# EAGLE schematic UCirKitBreadboardWithEverything2Top (EAGLE 7.3.0)
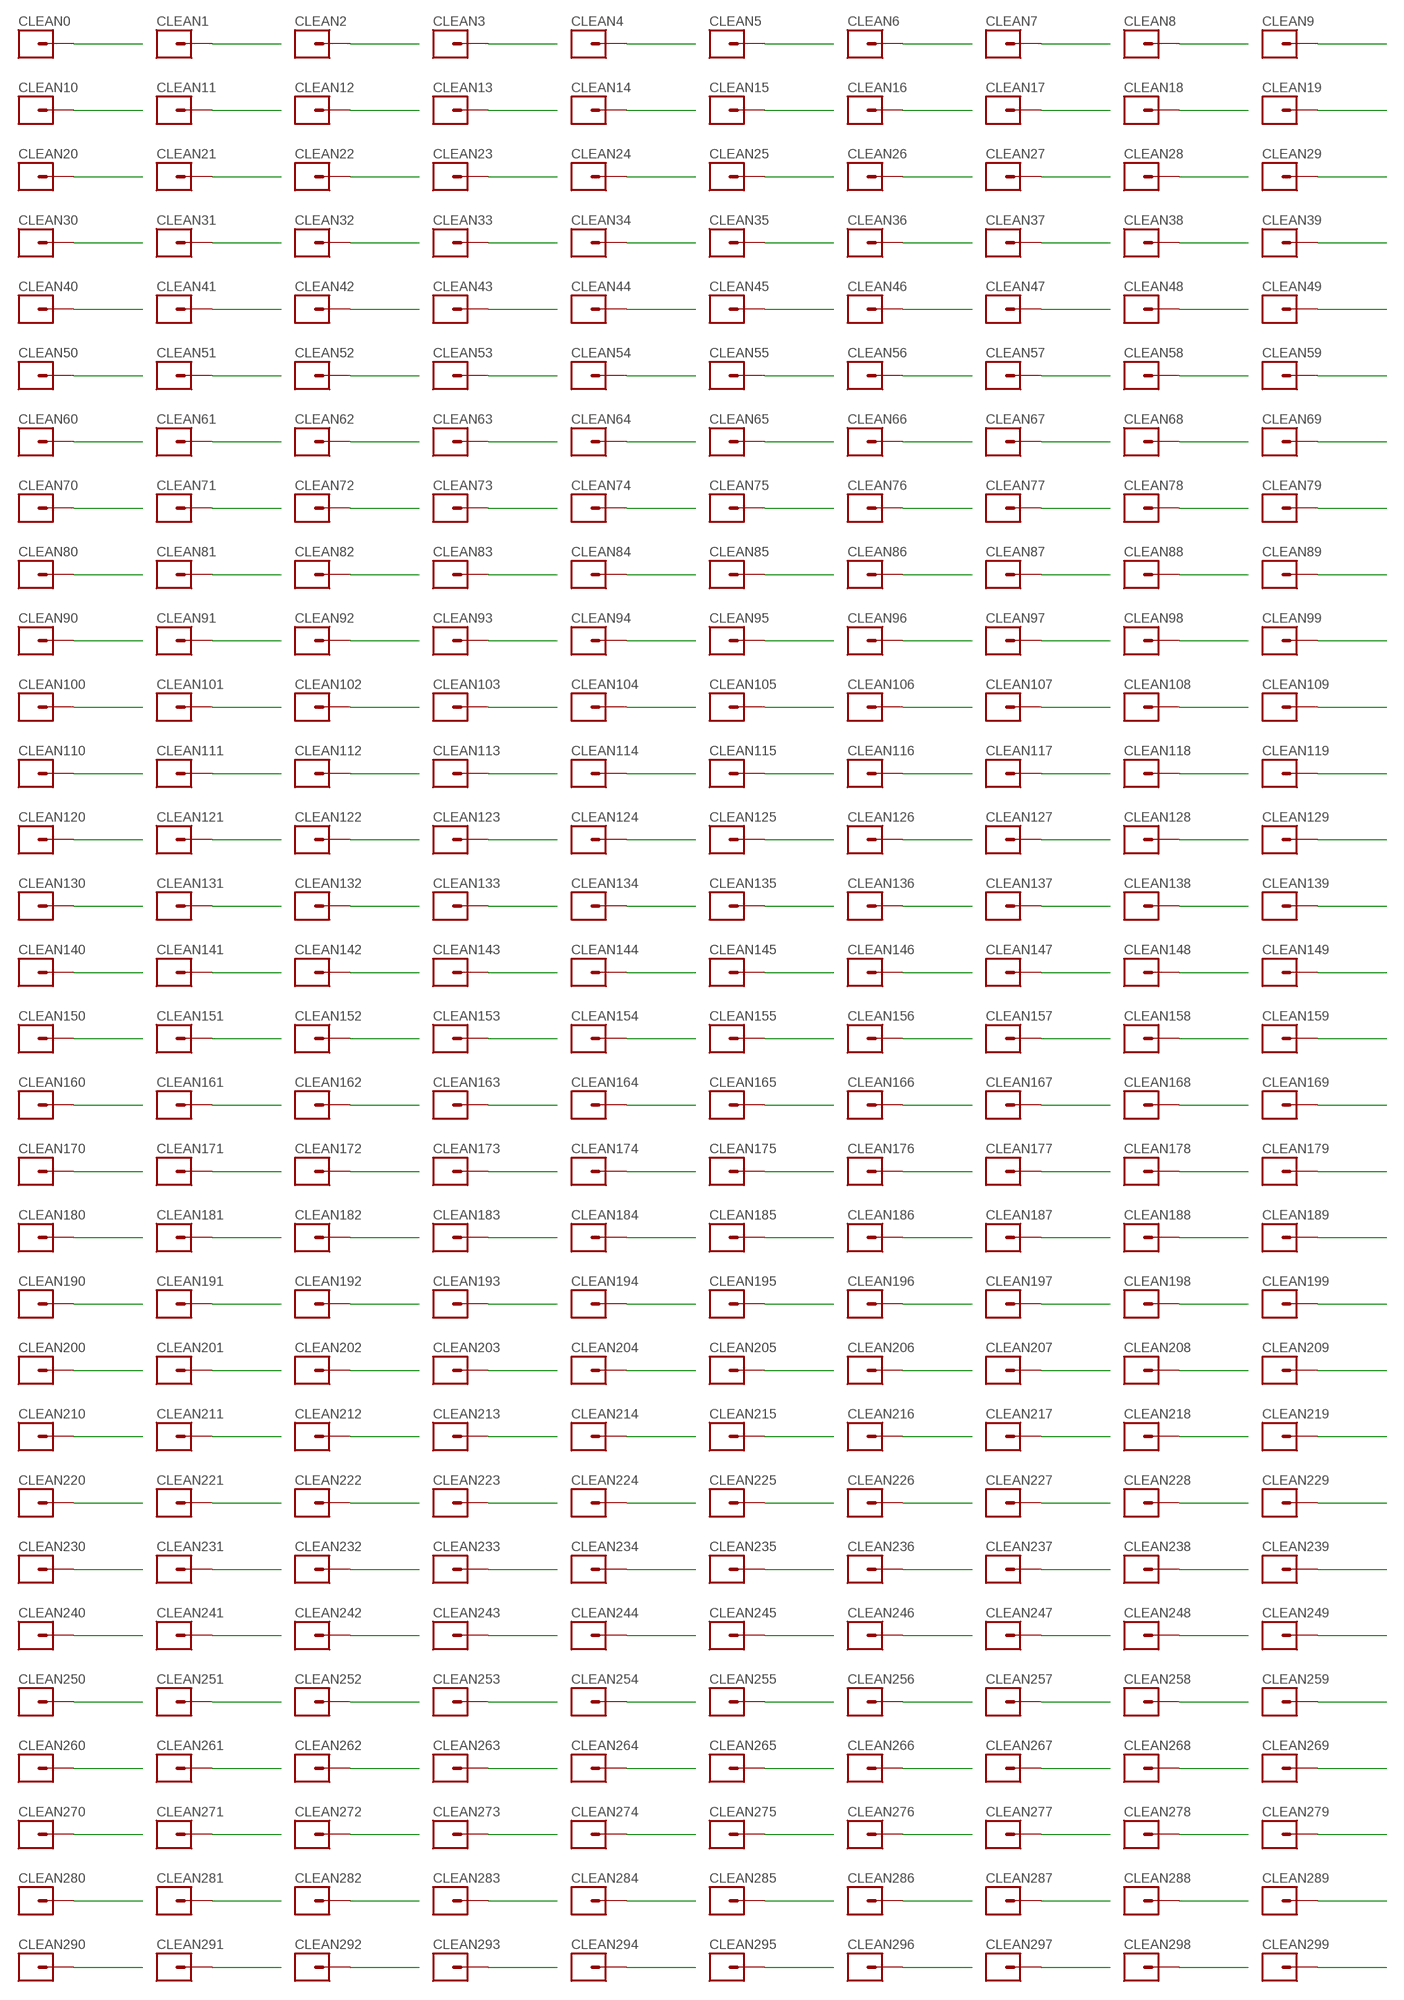
[diagram p0: schematic, sheet 1, part 1 of 2]
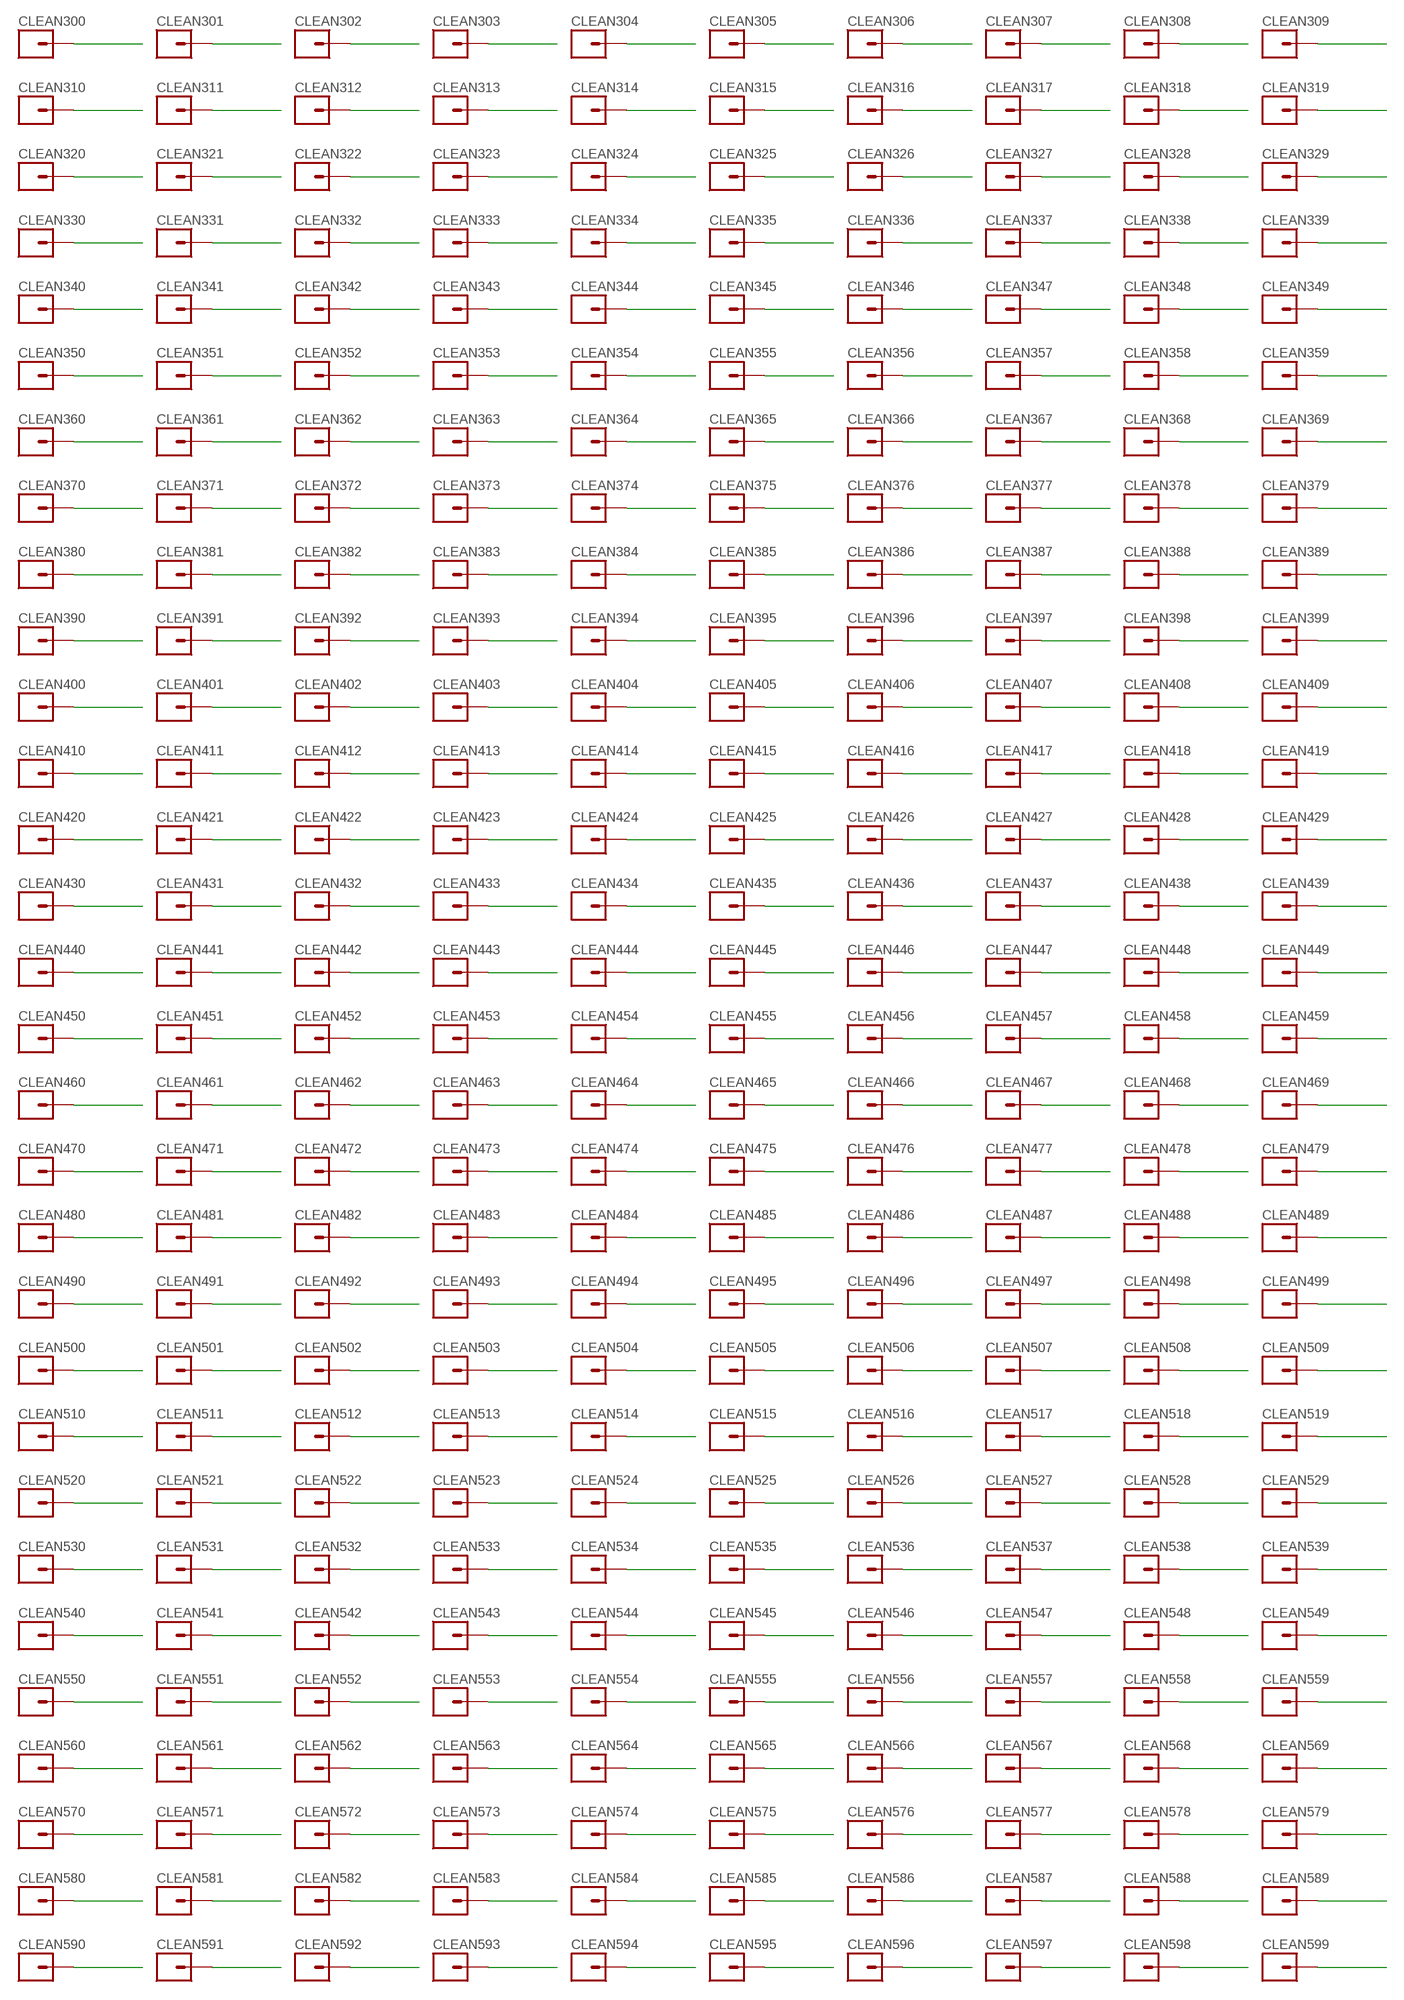
[diagram p1: schematic, sheet 1, part 2 of 2]

## Parts
CLEAN0  M01PTH_WITHOUT_TEXT  [1X01_WITHOUT_TEXT]
CLEAN1  M01PTH_WITHOUT_TEXT  [1X01_WITHOUT_TEXT]
CLEAN2  M01PTH_WITHOUT_TEXT  [1X01_WITHOUT_TEXT]
CLEAN3  M01PTH_WITHOUT_TEXT  [1X01_WITHOUT_TEXT]
CLEAN4  M01PTH_WITHOUT_TEXT  [1X01_WITHOUT_TEXT]
CLEAN5  M01PTH_WITHOUT_TEXT  [1X01_WITHOUT_TEXT]
CLEAN6  M01PTH_WITHOUT_TEXT  [1X01_WITHOUT_TEXT]
CLEAN7  M01PTH_WITHOUT_TEXT  [1X01_WITHOUT_TEXT]
CLEAN8  M01PTH_WITHOUT_TEXT  [1X01_WITHOUT_TEXT]
CLEAN9  M01PTH_WITHOUT_TEXT  [1X01_WITHOUT_TEXT]
CLEAN10  M01PTH_WITHOUT_TEXT  [1X01_WITHOUT_TEXT]
CLEAN11  M01PTH_WITHOUT_TEXT  [1X01_WITHOUT_TEXT]
CLEAN12  M01PTH_WITHOUT_TEXT  [1X01_WITHOUT_TEXT]
CLEAN13  M01PTH_WITHOUT_TEXT  [1X01_WITHOUT_TEXT]
CLEAN14  M01PTH_WITHOUT_TEXT  [1X01_WITHOUT_TEXT]
CLEAN15  M01PTH_WITHOUT_TEXT  [1X01_WITHOUT_TEXT]
CLEAN16  M01PTH_WITHOUT_TEXT  [1X01_WITHOUT_TEXT]
CLEAN17  M01PTH_WITHOUT_TEXT  [1X01_WITHOUT_TEXT]
CLEAN18  M01PTH_WITHOUT_TEXT  [1X01_WITHOUT_TEXT]
CLEAN19  M01PTH_WITHOUT_TEXT  [1X01_WITHOUT_TEXT]
CLEAN20  M01PTH_WITHOUT_TEXT  [1X01_WITHOUT_TEXT]
CLEAN21  M01PTH_WITHOUT_TEXT  [1X01_WITHOUT_TEXT]
CLEAN22  M01PTH_WITHOUT_TEXT  [1X01_WITHOUT_TEXT]
CLEAN23  M01PTH_WITHOUT_TEXT  [1X01_WITHOUT_TEXT]
CLEAN24  M01PTH_WITHOUT_TEXT  [1X01_WITHOUT_TEXT]
CLEAN25  M01PTH_WITHOUT_TEXT  [1X01_WITHOUT_TEXT]
CLEAN26  M01PTH_WITHOUT_TEXT  [1X01_WITHOUT_TEXT]
CLEAN27  M01PTH_WITHOUT_TEXT  [1X01_WITHOUT_TEXT]
CLEAN28  M01PTH_WITHOUT_TEXT  [1X01_WITHOUT_TEXT]
CLEAN29  M01PTH_WITHOUT_TEXT  [1X01_WITHOUT_TEXT]
CLEAN30  M01PTH_WITHOUT_TEXT  [1X01_WITHOUT_TEXT]
CLEAN31  M01PTH_WITHOUT_TEXT  [1X01_WITHOUT_TEXT]
CLEAN32  M01PTH_WITHOUT_TEXT  [1X01_WITHOUT_TEXT]
CLEAN33  M01PTH_WITHOUT_TEXT  [1X01_WITHOUT_TEXT]
CLEAN34  M01PTH_WITHOUT_TEXT  [1X01_WITHOUT_TEXT]
CLEAN35  M01PTH_WITHOUT_TEXT  [1X01_WITHOUT_TEXT]
CLEAN36  M01PTH_WITHOUT_TEXT  [1X01_WITHOUT_TEXT]
CLEAN37  M01PTH_WITHOUT_TEXT  [1X01_WITHOUT_TEXT]
CLEAN38  M01PTH_WITHOUT_TEXT  [1X01_WITHOUT_TEXT]
CLEAN39  M01PTH_WITHOUT_TEXT  [1X01_WITHOUT_TEXT]
CLEAN40  M01PTH_WITHOUT_TEXT  [1X01_WITHOUT_TEXT]
CLEAN41  M01PTH_WITHOUT_TEXT  [1X01_WITHOUT_TEXT]
CLEAN42  M01PTH_WITHOUT_TEXT  [1X01_WITHOUT_TEXT]
CLEAN43  M01PTH_WITHOUT_TEXT  [1X01_WITHOUT_TEXT]
CLEAN44  M01PTH_WITHOUT_TEXT  [1X01_WITHOUT_TEXT]
CLEAN45  M01PTH_WITHOUT_TEXT  [1X01_WITHOUT_TEXT]
CLEAN46  M01PTH_WITHOUT_TEXT  [1X01_WITHOUT_TEXT]
CLEAN47  M01PTH_WITHOUT_TEXT  [1X01_WITHOUT_TEXT]
CLEAN48  M01PTH_WITHOUT_TEXT  [1X01_WITHOUT_TEXT]
CLEAN49  M01PTH_WITHOUT_TEXT  [1X01_WITHOUT_TEXT]
CLEAN50  M01PTH_WITHOUT_TEXT  [1X01_WITHOUT_TEXT]
CLEAN51  M01PTH_WITHOUT_TEXT  [1X01_WITHOUT_TEXT]
CLEAN52  M01PTH_WITHOUT_TEXT  [1X01_WITHOUT_TEXT]
CLEAN53  M01PTH_WITHOUT_TEXT  [1X01_WITHOUT_TEXT]
CLEAN54  M01PTH_WITHOUT_TEXT  [1X01_WITHOUT_TEXT]
CLEAN55  M01PTH_WITHOUT_TEXT  [1X01_WITHOUT_TEXT]
CLEAN56  M01PTH_WITHOUT_TEXT  [1X01_WITHOUT_TEXT]
CLEAN57  M01PTH_WITHOUT_TEXT  [1X01_WITHOUT_TEXT]
CLEAN58  M01PTH_WITHOUT_TEXT  [1X01_WITHOUT_TEXT]
CLEAN59  M01PTH_WITHOUT_TEXT  [1X01_WITHOUT_TEXT]
CLEAN60  M01PTH_WITHOUT_TEXT  [1X01_WITHOUT_TEXT]
CLEAN61  M01PTH_WITHOUT_TEXT  [1X01_WITHOUT_TEXT]
CLEAN62  M01PTH_WITHOUT_TEXT  [1X01_WITHOUT_TEXT]
CLEAN63  M01PTH_WITHOUT_TEXT  [1X01_WITHOUT_TEXT]
CLEAN64  M01PTH_WITHOUT_TEXT  [1X01_WITHOUT_TEXT]
CLEAN65  M01PTH_WITHOUT_TEXT  [1X01_WITHOUT_TEXT]
CLEAN66  M01PTH_WITHOUT_TEXT  [1X01_WITHOUT_TEXT]
CLEAN67  M01PTH_WITHOUT_TEXT  [1X01_WITHOUT_TEXT]
CLEAN68  M01PTH_WITHOUT_TEXT  [1X01_WITHOUT_TEXT]
CLEAN69  M01PTH_WITHOUT_TEXT  [1X01_WITHOUT_TEXT]
CLEAN70  M01PTH_WITHOUT_TEXT  [1X01_WITHOUT_TEXT]
CLEAN71  M01PTH_WITHOUT_TEXT  [1X01_WITHOUT_TEXT]
CLEAN72  M01PTH_WITHOUT_TEXT  [1X01_WITHOUT_TEXT]
CLEAN73  M01PTH_WITHOUT_TEXT  [1X01_WITHOUT_TEXT]
CLEAN74  M01PTH_WITHOUT_TEXT  [1X01_WITHOUT_TEXT]
CLEAN75  M01PTH_WITHOUT_TEXT  [1X01_WITHOUT_TEXT]
CLEAN76  M01PTH_WITHOUT_TEXT  [1X01_WITHOUT_TEXT]
CLEAN77  M01PTH_WITHOUT_TEXT  [1X01_WITHOUT_TEXT]
CLEAN78  M01PTH_WITHOUT_TEXT  [1X01_WITHOUT_TEXT]
CLEAN79  M01PTH_WITHOUT_TEXT  [1X01_WITHOUT_TEXT]
CLEAN80  M01PTH_WITHOUT_TEXT  [1X01_WITHOUT_TEXT]
CLEAN81  M01PTH_WITHOUT_TEXT  [1X01_WITHOUT_TEXT]
CLEAN82  M01PTH_WITHOUT_TEXT  [1X01_WITHOUT_TEXT]
CLEAN83  M01PTH_WITHOUT_TEXT  [1X01_WITHOUT_TEXT]
CLEAN84  M01PTH_WITHOUT_TEXT  [1X01_WITHOUT_TEXT]
CLEAN85  M01PTH_WITHOUT_TEXT  [1X01_WITHOUT_TEXT]
CLEAN86  M01PTH_WITHOUT_TEXT  [1X01_WITHOUT_TEXT]
CLEAN87  M01PTH_WITHOUT_TEXT  [1X01_WITHOUT_TEXT]
CLEAN88  M01PTH_WITHOUT_TEXT  [1X01_WITHOUT_TEXT]
CLEAN89  M01PTH_WITHOUT_TEXT  [1X01_WITHOUT_TEXT]
CLEAN90  M01PTH_WITHOUT_TEXT  [1X01_WITHOUT_TEXT]
CLEAN91  M01PTH_WITHOUT_TEXT  [1X01_WITHOUT_TEXT]
CLEAN92  M01PTH_WITHOUT_TEXT  [1X01_WITHOUT_TEXT]
CLEAN93  M01PTH_WITHOUT_TEXT  [1X01_WITHOUT_TEXT]
CLEAN94  M01PTH_WITHOUT_TEXT  [1X01_WITHOUT_TEXT]
CLEAN95  M01PTH_WITHOUT_TEXT  [1X01_WITHOUT_TEXT]
CLEAN96  M01PTH_WITHOUT_TEXT  [1X01_WITHOUT_TEXT]
CLEAN97  M01PTH_WITHOUT_TEXT  [1X01_WITHOUT_TEXT]
CLEAN98  M01PTH_WITHOUT_TEXT  [1X01_WITHOUT_TEXT]
CLEAN99  M01PTH_WITHOUT_TEXT  [1X01_WITHOUT_TEXT]
CLEAN100  M01PTH_WITHOUT_TEXT  [1X01_WITHOUT_TEXT]
CLEAN101  M01PTH_WITHOUT_TEXT  [1X01_WITHOUT_TEXT]
CLEAN102  M01PTH_WITHOUT_TEXT  [1X01_WITHOUT_TEXT]
CLEAN103  M01PTH_WITHOUT_TEXT  [1X01_WITHOUT_TEXT]
CLEAN104  M01PTH_WITHOUT_TEXT  [1X01_WITHOUT_TEXT]
CLEAN105  M01PTH_WITHOUT_TEXT  [1X01_WITHOUT_TEXT]
CLEAN106  M01PTH_WITHOUT_TEXT  [1X01_WITHOUT_TEXT]
CLEAN107  M01PTH_WITHOUT_TEXT  [1X01_WITHOUT_TEXT]
CLEAN108  M01PTH_WITHOUT_TEXT  [1X01_WITHOUT_TEXT]
CLEAN109  M01PTH_WITHOUT_TEXT  [1X01_WITHOUT_TEXT]
CLEAN110  M01PTH_WITHOUT_TEXT  [1X01_WITHOUT_TEXT]
CLEAN111  M01PTH_WITHOUT_TEXT  [1X01_WITHOUT_TEXT]
CLEAN112  M01PTH_WITHOUT_TEXT  [1X01_WITHOUT_TEXT]
CLEAN113  M01PTH_WITHOUT_TEXT  [1X01_WITHOUT_TEXT]
CLEAN114  M01PTH_WITHOUT_TEXT  [1X01_WITHOUT_TEXT]
CLEAN115  M01PTH_WITHOUT_TEXT  [1X01_WITHOUT_TEXT]
CLEAN116  M01PTH_WITHOUT_TEXT  [1X01_WITHOUT_TEXT]
CLEAN117  M01PTH_WITHOUT_TEXT  [1X01_WITHOUT_TEXT]
CLEAN118  M01PTH_WITHOUT_TEXT  [1X01_WITHOUT_TEXT]
CLEAN119  M01PTH_WITHOUT_TEXT  [1X01_WITHOUT_TEXT]
CLEAN120  M01PTH_WITHOUT_TEXT  [1X01_WITHOUT_TEXT]
CLEAN121  M01PTH_WITHOUT_TEXT  [1X01_WITHOUT_TEXT]
CLEAN122  M01PTH_WITHOUT_TEXT  [1X01_WITHOUT_TEXT]
CLEAN123  M01PTH_WITHOUT_TEXT  [1X01_WITHOUT_TEXT]
CLEAN124  M01PTH_WITHOUT_TEXT  [1X01_WITHOUT_TEXT]
CLEAN125  M01PTH_WITHOUT_TEXT  [1X01_WITHOUT_TEXT]
CLEAN126  M01PTH_WITHOUT_TEXT  [1X01_WITHOUT_TEXT]
CLEAN127  M01PTH_WITHOUT_TEXT  [1X01_WITHOUT_TEXT]
CLEAN128  M01PTH_WITHOUT_TEXT  [1X01_WITHOUT_TEXT]
CLEAN129  M01PTH_WITHOUT_TEXT  [1X01_WITHOUT_TEXT]
CLEAN130  M01PTH_WITHOUT_TEXT  [1X01_WITHOUT_TEXT]
CLEAN131  M01PTH_WITHOUT_TEXT  [1X01_WITHOUT_TEXT]
CLEAN132  M01PTH_WITHOUT_TEXT  [1X01_WITHOUT_TEXT]
CLEAN133  M01PTH_WITHOUT_TEXT  [1X01_WITHOUT_TEXT]
CLEAN134  M01PTH_WITHOUT_TEXT  [1X01_WITHOUT_TEXT]
CLEAN135  M01PTH_WITHOUT_TEXT  [1X01_WITHOUT_TEXT]
CLEAN136  M01PTH_WITHOUT_TEXT  [1X01_WITHOUT_TEXT]
CLEAN137  M01PTH_WITHOUT_TEXT  [1X01_WITHOUT_TEXT]
CLEAN138  M01PTH_WITHOUT_TEXT  [1X01_WITHOUT_TEXT]
CLEAN139  M01PTH_WITHOUT_TEXT  [1X01_WITHOUT_TEXT]
CLEAN140  M01PTH_WITHOUT_TEXT  [1X01_WITHOUT_TEXT]
CLEAN141  M01PTH_WITHOUT_TEXT  [1X01_WITHOUT_TEXT]
CLEAN142  M01PTH_WITHOUT_TEXT  [1X01_WITHOUT_TEXT]
CLEAN143  M01PTH_WITHOUT_TEXT  [1X01_WITHOUT_TEXT]
CLEAN144  M01PTH_WITHOUT_TEXT  [1X01_WITHOUT_TEXT]
CLEAN145  M01PTH_WITHOUT_TEXT  [1X01_WITHOUT_TEXT]
CLEAN146  M01PTH_WITHOUT_TEXT  [1X01_WITHOUT_TEXT]
CLEAN147  M01PTH_WITHOUT_TEXT  [1X01_WITHOUT_TEXT]
CLEAN148  M01PTH_WITHOUT_TEXT  [1X01_WITHOUT_TEXT]
CLEAN149  M01PTH_WITHOUT_TEXT  [1X01_WITHOUT_TEXT]
CLEAN150  M01PTH_WITHOUT_TEXT  [1X01_WITHOUT_TEXT]
CLEAN151  M01PTH_WITHOUT_TEXT  [1X01_WITHOUT_TEXT]
CLEAN152  M01PTH_WITHOUT_TEXT  [1X01_WITHOUT_TEXT]
CLEAN153  M01PTH_WITHOUT_TEXT  [1X01_WITHOUT_TEXT]
CLEAN154  M01PTH_WITHOUT_TEXT  [1X01_WITHOUT_TEXT]
CLEAN155  M01PTH_WITHOUT_TEXT  [1X01_WITHOUT_TEXT]
CLEAN156  M01PTH_WITHOUT_TEXT  [1X01_WITHOUT_TEXT]
CLEAN157  M01PTH_WITHOUT_TEXT  [1X01_WITHOUT_TEXT]
CLEAN158  M01PTH_WITHOUT_TEXT  [1X01_WITHOUT_TEXT]
CLEAN159  M01PTH_WITHOUT_TEXT  [1X01_WITHOUT_TEXT]
CLEAN160  M01PTH_WITHOUT_TEXT  [1X01_WITHOUT_TEXT]
CLEAN161  M01PTH_WITHOUT_TEXT  [1X01_WITHOUT_TEXT]
CLEAN162  M01PTH_WITHOUT_TEXT  [1X01_WITHOUT_TEXT]
CLEAN163  M01PTH_WITHOUT_TEXT  [1X01_WITHOUT_TEXT]
CLEAN164  M01PTH_WITHOUT_TEXT  [1X01_WITHOUT_TEXT]
CLEAN165  M01PTH_WITHOUT_TEXT  [1X01_WITHOUT_TEXT]
CLEAN166  M01PTH_WITHOUT_TEXT  [1X01_WITHOUT_TEXT]
CLEAN167  M01PTH_WITHOUT_TEXT  [1X01_WITHOUT_TEXT]
CLEAN168  M01PTH_WITHOUT_TEXT  [1X01_WITHOUT_TEXT]
CLEAN169  M01PTH_WITHOUT_TEXT  [1X01_WITHOUT_TEXT]
CLEAN170  M01PTH_WITHOUT_TEXT  [1X01_WITHOUT_TEXT]
CLEAN171  M01PTH_WITHOUT_TEXT  [1X01_WITHOUT_TEXT]
CLEAN172  M01PTH_WITHOUT_TEXT  [1X01_WITHOUT_TEXT]
CLEAN173  M01PTH_WITHOUT_TEXT  [1X01_WITHOUT_TEXT]
CLEAN174  M01PTH_WITHOUT_TEXT  [1X01_WITHOUT_TEXT]
CLEAN175  M01PTH_WITHOUT_TEXT  [1X01_WITHOUT_TEXT]
CLEAN176  M01PTH_WITHOUT_TEXT  [1X01_WITHOUT_TEXT]
CLEAN177  M01PTH_WITHOUT_TEXT  [1X01_WITHOUT_TEXT]
CLEAN178  M01PTH_WITHOUT_TEXT  [1X01_WITHOUT_TEXT]
CLEAN179  M01PTH_WITHOUT_TEXT  [1X01_WITHOUT_TEXT]
CLEAN180  M01PTH_WITHOUT_TEXT  [1X01_WITHOUT_TEXT]
CLEAN181  M01PTH_WITHOUT_TEXT  [1X01_WITHOUT_TEXT]
CLEAN182  M01PTH_WITHOUT_TEXT  [1X01_WITHOUT_TEXT]
CLEAN183  M01PTH_WITHOUT_TEXT  [1X01_WITHOUT_TEXT]
CLEAN184  M01PTH_WITHOUT_TEXT  [1X01_WITHOUT_TEXT]
CLEAN185  M01PTH_WITHOUT_TEXT  [1X01_WITHOUT_TEXT]
CLEAN186  M01PTH_WITHOUT_TEXT  [1X01_WITHOUT_TEXT]
CLEAN187  M01PTH_WITHOUT_TEXT  [1X01_WITHOUT_TEXT]
CLEAN188  M01PTH_WITHOUT_TEXT  [1X01_WITHOUT_TEXT]
CLEAN189  M01PTH_WITHOUT_TEXT  [1X01_WITHOUT_TEXT]
CLEAN190  M01PTH_WITHOUT_TEXT  [1X01_WITHOUT_TEXT]
CLEAN191  M01PTH_WITHOUT_TEXT  [1X01_WITHOUT_TEXT]
CLEAN192  M01PTH_WITHOUT_TEXT  [1X01_WITHOUT_TEXT]
CLEAN193  M01PTH_WITHOUT_TEXT  [1X01_WITHOUT_TEXT]
CLEAN194  M01PTH_WITHOUT_TEXT  [1X01_WITHOUT_TEXT]
CLEAN195  M01PTH_WITHOUT_TEXT  [1X01_WITHOUT_TEXT]
CLEAN196  M01PTH_WITHOUT_TEXT  [1X01_WITHOUT_TEXT]
CLEAN197  M01PTH_WITHOUT_TEXT  [1X01_WITHOUT_TEXT]
CLEAN198  M01PTH_WITHOUT_TEXT  [1X01_WITHOUT_TEXT]
CLEAN199  M01PTH_WITHOUT_TEXT  [1X01_WITHOUT_TEXT]
CLEAN200  M01PTH_WITHOUT_TEXT  [1X01_WITHOUT_TEXT]
CLEAN201  M01PTH_WITHOUT_TEXT  [1X01_WITHOUT_TEXT]
CLEAN202  M01PTH_WITHOUT_TEXT  [1X01_WITHOUT_TEXT]
CLEAN203  M01PTH_WITHOUT_TEXT  [1X01_WITHOUT_TEXT]
CLEAN204  M01PTH_WITHOUT_TEXT  [1X01_WITHOUT_TEXT]
CLEAN205  M01PTH_WITHOUT_TEXT  [1X01_WITHOUT_TEXT]
CLEAN206  M01PTH_WITHOUT_TEXT  [1X01_WITHOUT_TEXT]
CLEAN207  M01PTH_WITHOUT_TEXT  [1X01_WITHOUT_TEXT]
CLEAN208  M01PTH_WITHOUT_TEXT  [1X01_WITHOUT_TEXT]
CLEAN209  M01PTH_WITHOUT_TEXT  [1X01_WITHOUT_TEXT]
CLEAN210  M01PTH_WITHOUT_TEXT  [1X01_WITHOUT_TEXT]
CLEAN211  M01PTH_WITHOUT_TEXT  [1X01_WITHOUT_TEXT]
CLEAN212  M01PTH_WITHOUT_TEXT  [1X01_WITHOUT_TEXT]
CLEAN213  M01PTH_WITHOUT_TEXT  [1X01_WITHOUT_TEXT]
CLEAN214  M01PTH_WITHOUT_TEXT  [1X01_WITHOUT_TEXT]
CLEAN215  M01PTH_WITHOUT_TEXT  [1X01_WITHOUT_TEXT]
CLEAN216  M01PTH_WITHOUT_TEXT  [1X01_WITHOUT_TEXT]
CLEAN217  M01PTH_WITHOUT_TEXT  [1X01_WITHOUT_TEXT]
CLEAN218  M01PTH_WITHOUT_TEXT  [1X01_WITHOUT_TEXT]
CLEAN219  M01PTH_WITHOUT_TEXT  [1X01_WITHOUT_TEXT]
CLEAN220  M01PTH_WITHOUT_TEXT  [1X01_WITHOUT_TEXT]
CLEAN221  M01PTH_WITHOUT_TEXT  [1X01_WITHOUT_TEXT]
CLEAN222  M01PTH_WITHOUT_TEXT  [1X01_WITHOUT_TEXT]
CLEAN223  M01PTH_WITHOUT_TEXT  [1X01_WITHOUT_TEXT]
CLEAN224  M01PTH_WITHOUT_TEXT  [1X01_WITHOUT_TEXT]
CLEAN225  M01PTH_WITHOUT_TEXT  [1X01_WITHOUT_TEXT]
CLEAN226  M01PTH_WITHOUT_TEXT  [1X01_WITHOUT_TEXT]
CLEAN227  M01PTH_WITHOUT_TEXT  [1X01_WITHOUT_TEXT]
CLEAN228  M01PTH_WITHOUT_TEXT  [1X01_WITHOUT_TEXT]
CLEAN229  M01PTH_WITHOUT_TEXT  [1X01_WITHOUT_TEXT]
CLEAN230  M01PTH_WITHOUT_TEXT  [1X01_WITHOUT_TEXT]
CLEAN231  M01PTH_WITHOUT_TEXT  [1X01_WITHOUT_TEXT]
CLEAN232  M01PTH_WITHOUT_TEXT  [1X01_WITHOUT_TEXT]
CLEAN233  M01PTH_WITHOUT_TEXT  [1X01_WITHOUT_TEXT]
CLEAN234  M01PTH_WITHOUT_TEXT  [1X01_WITHOUT_TEXT]
CLEAN235  M01PTH_WITHOUT_TEXT  [1X01_WITHOUT_TEXT]
CLEAN236  M01PTH_WITHOUT_TEXT  [1X01_WITHOUT_TEXT]
CLEAN237  M01PTH_WITHOUT_TEXT  [1X01_WITHOUT_TEXT]
CLEAN238  M01PTH_WITHOUT_TEXT  [1X01_WITHOUT_TEXT]
CLEAN239  M01PTH_WITHOUT_TEXT  [1X01_WITHOUT_TEXT]
CLEAN240  M01PTH_WITHOUT_TEXT  [1X01_WITHOUT_TEXT]
CLEAN241  M01PTH_WITHOUT_TEXT  [1X01_WITHOUT_TEXT]
CLEAN242  M01PTH_WITHOUT_TEXT  [1X01_WITHOUT_TEXT]
CLEAN243  M01PTH_WITHOUT_TEXT  [1X01_WITHOUT_TEXT]
CLEAN244  M01PTH_WITHOUT_TEXT  [1X01_WITHOUT_TEXT]
CLEAN245  M01PTH_WITHOUT_TEXT  [1X01_WITHOUT_TEXT]
CLEAN246  M01PTH_WITHOUT_TEXT  [1X01_WITHOUT_TEXT]
CLEAN247  M01PTH_WITHOUT_TEXT  [1X01_WITHOUT_TEXT]
CLEAN248  M01PTH_WITHOUT_TEXT  [1X01_WITHOUT_TEXT]
CLEAN249  M01PTH_WITHOUT_TEXT  [1X01_WITHOUT_TEXT]
CLEAN250  M01PTH_WITHOUT_TEXT  [1X01_WITHOUT_TEXT]
CLEAN251  M01PTH_WITHOUT_TEXT  [1X01_WITHOUT_TEXT]
CLEAN252  M01PTH_WITHOUT_TEXT  [1X01_WITHOUT_TEXT]
CLEAN253  M01PTH_WITHOUT_TEXT  [1X01_WITHOUT_TEXT]
CLEAN254  M01PTH_WITHOUT_TEXT  [1X01_WITHOUT_TEXT]
CLEAN255  M01PTH_WITHOUT_TEXT  [1X01_WITHOUT_TEXT]
CLEAN256  M01PTH_WITHOUT_TEXT  [1X01_WITHOUT_TEXT]
CLEAN257  M01PTH_WITHOUT_TEXT  [1X01_WITHOUT_TEXT]
CLEAN258  M01PTH_WITHOUT_TEXT  [1X01_WITHOUT_TEXT]
CLEAN259  M01PTH_WITHOUT_TEXT  [1X01_WITHOUT_TEXT]
CLEAN260  M01PTH_WITHOUT_TEXT  [1X01_WITHOUT_TEXT]
CLEAN261  M01PTH_WITHOUT_TEXT  [1X01_WITHOUT_TEXT]
CLEAN262  M01PTH_WITHOUT_TEXT  [1X01_WITHOUT_TEXT]
CLEAN263  M01PTH_WITHOUT_TEXT  [1X01_WITHOUT_TEXT]
CLEAN264  M01PTH_WITHOUT_TEXT  [1X01_WITHOUT_TEXT]
CLEAN265  M01PTH_WITHOUT_TEXT  [1X01_WITHOUT_TEXT]
CLEAN266  M01PTH_WITHOUT_TEXT  [1X01_WITHOUT_TEXT]
CLEAN267  M01PTH_WITHOUT_TEXT  [1X01_WITHOUT_TEXT]
CLEAN268  M01PTH_WITHOUT_TEXT  [1X01_WITHOUT_TEXT]
CLEAN269  M01PTH_WITHOUT_TEXT  [1X01_WITHOUT_TEXT]
CLEAN270  M01PTH_WITHOUT_TEXT  [1X01_WITHOUT_TEXT]
CLEAN271  M01PTH_WITHOUT_TEXT  [1X01_WITHOUT_TEXT]
CLEAN272  M01PTH_WITHOUT_TEXT  [1X01_WITHOUT_TEXT]
CLEAN273  M01PTH_WITHOUT_TEXT  [1X01_WITHOUT_TEXT]
CLEAN274  M01PTH_WITHOUT_TEXT  [1X01_WITHOUT_TEXT]
CLEAN275  M01PTH_WITHOUT_TEXT  [1X01_WITHOUT_TEXT]
CLEAN276  M01PTH_WITHOUT_TEXT  [1X01_WITHOUT_TEXT]
CLEAN277  M01PTH_WITHOUT_TEXT  [1X01_WITHOUT_TEXT]
CLEAN278  M01PTH_WITHOUT_TEXT  [1X01_WITHOUT_TEXT]
CLEAN279  M01PTH_WITHOUT_TEXT  [1X01_WITHOUT_TEXT]
CLEAN280  M01PTH_WITHOUT_TEXT  [1X01_WITHOUT_TEXT]
CLEAN281  M01PTH_WITHOUT_TEXT  [1X01_WITHOUT_TEXT]
CLEAN282  M01PTH_WITHOUT_TEXT  [1X01_WITHOUT_TEXT]
CLEAN283  M01PTH_WITHOUT_TEXT  [1X01_WITHOUT_TEXT]
CLEAN284  M01PTH_WITHOUT_TEXT  [1X01_WITHOUT_TEXT]
CLEAN285  M01PTH_WITHOUT_TEXT  [1X01_WITHOUT_TEXT]
CLEAN286  M01PTH_WITHOUT_TEXT  [1X01_WITHOUT_TEXT]
CLEAN287  M01PTH_WITHOUT_TEXT  [1X01_WITHOUT_TEXT]
CLEAN288  M01PTH_WITHOUT_TEXT  [1X01_WITHOUT_TEXT]
CLEAN289  M01PTH_WITHOUT_TEXT  [1X01_WITHOUT_TEXT]
CLEAN290  M01PTH_WITHOUT_TEXT  [1X01_WITHOUT_TEXT]
CLEAN291  M01PTH_WITHOUT_TEXT  [1X01_WITHOUT_TEXT]
CLEAN292  M01PTH_WITHOUT_TEXT  [1X01_WITHOUT_TEXT]
CLEAN293  M01PTH_WITHOUT_TEXT  [1X01_WITHOUT_TEXT]
CLEAN294  M01PTH_WITHOUT_TEXT  [1X01_WITHOUT_TEXT]
CLEAN295  M01PTH_WITHOUT_TEXT  [1X01_WITHOUT_TEXT]
CLEAN296  M01PTH_WITHOUT_TEXT  [1X01_WITHOUT_TEXT]
CLEAN297  M01PTH_WITHOUT_TEXT  [1X01_WITHOUT_TEXT]
CLEAN298  M01PTH_WITHOUT_TEXT  [1X01_WITHOUT_TEXT]
CLEAN299  M01PTH_WITHOUT_TEXT  [1X01_WITHOUT_TEXT]
CLEAN300  M01PTH_SMD_3.25X0.85MM_NO_SILK  [1X01_SMD_3.25X0.85MM_NO_SILK]
CLEAN301  M01PTH_SMD_3.25X0.85MM_NO_SILK  [1X01_SMD_3.25X0.85MM_NO_SILK]
CLEAN302  M01PTH_SMD_3.25X0.85MM_NO_SILK  [1X01_SMD_3.25X0.85MM_NO_SILK]
CLEAN303  M01PTH_SMD_3.25X0.85MM_NO_SILK  [1X01_SMD_3.25X0.85MM_NO_SILK]
CLEAN304  M01PTH_SMD_3.25X0.85MM_NO_SILK  [1X01_SMD_3.25X0.85MM_NO_SILK]
CLEAN305  M01PTH_SMD_3.25X0.85MM_NO_SILK  [1X01_SMD_3.25X0.85MM_NO_SILK]
CLEAN306  M01PTH_SMD_3.25X0.85MM_NO_SILK  [1X01_SMD_3.25X0.85MM_NO_SILK]
CLEAN307  M01PTH_SMD_3.25X0.85MM_NO_SILK  [1X01_SMD_3.25X0.85MM_NO_SILK]
CLEAN308  M01PTH_SMD_3.25X0.85MM_NO_SILK  [1X01_SMD_3.25X0.85MM_NO_SILK]
CLEAN309  M01PTH_SMD_3.25X0.85MM_NO_SILK  [1X01_SMD_3.25X0.85MM_NO_SILK]
CLEAN310  M01PTH_SMD_3.25X0.85MM_NO_SILK  [1X01_SMD_3.25X0.85MM_NO_SILK]
CLEAN311  M01PTH_SMD_3.25X0.85MM_NO_SILK  [1X01_SMD_3.25X0.85MM_NO_SILK]
CLEAN312  M01PTH_SMD_3.25X0.85MM_NO_SILK  [1X01_SMD_3.25X0.85MM_NO_SILK]
CLEAN313  M01PTH_SMD_3.25X0.85MM_NO_SILK  [1X01_SMD_3.25X0.85MM_NO_SILK]
CLEAN314  M01PTH_SMD_3.25X0.85MM_NO_SILK  [1X01_SMD_3.25X0.85MM_NO_SILK]
CLEAN315  M01PTH_SMD_3.25X0.85MM_NO_SILK  [1X01_SMD_3.25X0.85MM_NO_SILK]
CLEAN316  M01PTH_SMD_3.25X0.85MM_NO_SILK  [1X01_SMD_3.25X0.85MM_NO_SILK]
CLEAN317  M01PTH_SMD_3.25X0.85MM_NO_SILK  [1X01_SMD_3.25X0.85MM_NO_SILK]
CLEAN318  M01PTH_SMD_3.25X0.85MM_NO_SILK  [1X01_SMD_3.25X0.85MM_NO_SILK]
CLEAN319  M01PTH_SMD_3.25X0.85MM_NO_SILK  [1X01_SMD_3.25X0.85MM_NO_SILK]
CLEAN320  M01PTH_SMD_3.25X0.85MM_NO_SILK  [1X01_SMD_3.25X0.85MM_NO_SILK]
CLEAN321  M01PTH_SMD_3.25X0.85MM_NO_SILK  [1X01_SMD_3.25X0.85MM_NO_SILK]
CLEAN322  M01PTH_SMD_3.25X0.85MM_NO_SILK  [1X01_SMD_3.25X0.85MM_NO_SILK]
CLEAN323  M01PTH_SMD_3.25X0.85MM_NO_SILK  [1X01_SMD_3.25X0.85MM_NO_SILK]
CLEAN324  M01PTH_SMD_3.25X0.85MM_NO_SILK  [1X01_SMD_3.25X0.85MM_NO_SILK]
CLEAN325  M01PTH_SMD_3.25X0.85MM_NO_SILK  [1X01_SMD_3.25X0.85MM_NO_SILK]
CLEAN326  M01PTH_SMD_3.25X0.85MM_NO_SILK  [1X01_SMD_3.25X0.85MM_NO_SILK]
CLEAN327  M01PTH_SMD_3.25X0.85MM_NO_SILK  [1X01_SMD_3.25X0.85MM_NO_SILK]
CLEAN328  M01PTH_SMD_3.25X0.85MM_NO_SILK  [1X01_SMD_3.25X0.85MM_NO_SILK]
CLEAN329  M01PTH_SMD_3.25X0.85MM_NO_SILK  [1X01_SMD_3.25X0.85MM_NO_SILK]
CLEAN330  M01PTH_SMD_3.25X0.85MM_NO_SILK  [1X01_SMD_3.25X0.85MM_NO_SILK]
CLEAN331  M01PTH_SMD_3.25X0.85MM_NO_SILK  [1X01_SMD_3.25X0.85MM_NO_SILK]
CLEAN332  M01PTH_SMD_3.25X0.85MM_NO_SILK  [1X01_SMD_3.25X0.85MM_NO_SILK]
CLEAN333  M01PTH_SMD_3.25X0.85MM_NO_SILK  [1X01_SMD_3.25X0.85MM_NO_SILK]
CLEAN334  M01PTH_SMD_3.25X0.85MM_NO_SILK  [1X01_SMD_3.25X0.85MM_NO_SILK]
CLEAN335  M01PTH_SMD_3.25X0.85MM_NO_SILK  [1X01_SMD_3.25X0.85MM_NO_SILK]
CLEAN336  M01PTH_SMD_3.25X0.85MM_NO_SILK  [1X01_SMD_3.25X0.85MM_NO_SILK]
CLEAN337  M01PTH_SMD_3.25X0.85MM_NO_SILK  [1X01_SMD_3.25X0.85MM_NO_SILK]
CLEAN338  M01PTH_SMD_3.25X0.85MM_NO_SILK  [1X01_SMD_3.25X0.85MM_NO_SILK]
CLEAN339  M01PTH_SMD_3.25X0.85MM_NO_SILK  [1X01_SMD_3.25X0.85MM_NO_SILK]
CLEAN340  M01PTH_SMD_3.25X0.85MM_NO_SILK  [1X01_SMD_3.25X0.85MM_NO_SILK]
CLEAN341  M01PTH_SMD_3.25X0.85MM_NO_SILK  [1X01_SMD_3.25X0.85MM_NO_SILK]
CLEAN342  M01PTH_SMD_3.25X0.85MM_NO_SILK  [1X01_SMD_3.25X0.85MM_NO_SILK]
CLEAN343  M01PTH_SMD_3.25X0.85MM_NO_SILK  [1X01_SMD_3.25X0.85MM_NO_SILK]
CLEAN344  M01PTH_SMD_3.25X0.85MM_NO_SILK  [1X01_SMD_3.25X0.85MM_NO_SILK]
CLEAN345  M01PTH_SMD_3.25X0.85MM_NO_SILK  [1X01_SMD_3.25X0.85MM_NO_SILK]
CLEAN346  M01PTH_SMD_3.25X0.85MM_NO_SILK  [1X01_SMD_3.25X0.85MM_NO_SILK]
CLEAN347  M01PTH_SMD_3.25X0.85MM_NO_SILK  [1X01_SMD_3.25X0.85MM_NO_SILK]
CLEAN348  M01PTH_SMD_3.25X0.85MM_NO_SILK  [1X01_SMD_3.25X0.85MM_NO_SILK]
CLEAN349  M01PTH_SMD_3.25X0.85MM_NO_SILK  [1X01_SMD_3.25X0.85MM_NO_SILK]
CLEAN350  M01PTH_SMD_3.25X0.85MM_NO_SILK  [1X01_SMD_3.25X0.85MM_NO_SILK]
CLEAN351  M01PTH_SMD_3.25X0.85MM_NO_SILK  [1X01_SMD_3.25X0.85MM_NO_SILK]
CLEAN352  M01PTH_SMD_3.25X0.85MM_NO_SILK  [1X01_SMD_3.25X0.85MM_NO_SILK]
CLEAN353  M01PTH_SMD_3.25X0.85MM_NO_SILK  [1X01_SMD_3.25X0.85MM_NO_SILK]
CLEAN354  M01PTH_SMD_3.25X0.85MM_NO_SILK  [1X01_SMD_3.25X0.85MM_NO_SILK]
CLEAN355  M01PTH_SMD_3.25X0.85MM_NO_SILK  [1X01_SMD_3.25X0.85MM_NO_SILK]
CLEAN356  M01PTH_SMD_3.25X0.85MM_NO_SILK  [1X01_SMD_3.25X0.85MM_NO_SILK]
CLEAN357  M01PTH_SMD_3.25X0.85MM_NO_SILK  [1X01_SMD_3.25X0.85MM_NO_SILK]
CLEAN358  M01PTH_SMD_3.25X0.85MM_NO_SILK  [1X01_SMD_3.25X0.85MM_NO_SILK]
CLEAN359  M01PTH_SMD_3.25X0.85MM_NO_SILK  [1X01_SMD_3.25X0.85MM_NO_SILK]
CLEAN360  M01PTH_SMD_3.25X0.85MM_NO_SILK  [1X01_SMD_3.25X0.85MM_NO_SILK]
CLEAN361  M01PTH_SMD_3.25X0.85MM_NO_SILK  [1X01_SMD_3.25X0.85MM_NO_SILK]
CLEAN362  M01PTH_SMD_3.25X0.85MM_NO_SILK  [1X01_SMD_3.25X0.85MM_NO_SILK]
CLEAN363  M01PTH_SMD_3.25X0.85MM_NO_SILK  [1X01_SMD_3.25X0.85MM_NO_SILK]
CLEAN364  M01PTH_SMD_3.25X0.85MM_NO_SILK  [1X01_SMD_3.25X0.85MM_NO_SILK]
CLEAN365  M01PTH_SMD_3.25X0.85MM_NO_SILK  [1X01_SMD_3.25X0.85MM_NO_SILK]
CLEAN366  M01PTH_SMD_3.25X0.85MM_NO_SILK  [1X01_SMD_3.25X0.85MM_NO_SILK]
CLEAN367  M01PTH_SMD_3.25X0.85MM_NO_SILK  [1X01_SMD_3.25X0.85MM_NO_SILK]
CLEAN368  M01PTH_SMD_3.25X0.85MM_NO_SILK  [1X01_SMD_3.25X0.85MM_NO_SILK]
CLEAN369  M01PTH_SMD_3.25X0.85MM_NO_SILK  [1X01_SMD_3.25X0.85MM_NO_SILK]
CLEAN370  M01PTH_SMD_3.25X0.85MM_NO_SILK  [1X01_SMD_3.25X0.85MM_NO_SILK]
CLEAN371  M01PTH_SMD_3.25X0.85MM_NO_SILK  [1X01_SMD_3.25X0.85MM_NO_SILK]
CLEAN372  M01PTH_SMD_3.25X0.85MM_NO_SILK  [1X01_SMD_3.25X0.85MM_NO_SILK]
CLEAN373  M01PTH_SMD_3.25X0.85MM_NO_SILK  [1X01_SMD_3.25X0.85MM_NO_SILK]
CLEAN374  M01PTH_SMD_3.25X0.85MM_NO_SILK  [1X01_SMD_3.25X0.85MM_NO_SILK]
CLEAN375  M01PTH_SMD_3.25X0.85MM_NO_SILK  [1X01_SMD_3.25X0.85MM_NO_SILK]
CLEAN376  M01PTH_SMD_3.25X0.85MM_NO_SILK  [1X01_SMD_3.25X0.85MM_NO_SILK]
CLEAN377  M01PTH_SMD_3.25X0.85MM_NO_SILK  [1X01_SMD_3.25X0.85MM_NO_SILK]
CLEAN378  M01PTH_SMD_3.25X0.85MM_NO_SILK  [1X01_SMD_3.25X0.85MM_NO_SILK]
CLEAN379  M01PTH_SMD_3.25X0.85MM_NO_SILK  [1X01_SMD_3.25X0.85MM_NO_SILK]
CLEAN380  M01PTH_SMD_3.25X0.85MM_NO_SILK  [1X01_SMD_3.25X0.85MM_NO_SILK]
CLEAN381  M01PTH_SMD_3.25X0.85MM_NO_SILK  [1X01_SMD_3.25X0.85MM_NO_SILK]
CLEAN382  M01PTH_SMD_3.25X0.85MM_NO_SILK  [1X01_SMD_3.25X0.85MM_NO_SILK]
CLEAN383  M01PTH_SMD_3.25X0.85MM_NO_SILK  [1X01_SMD_3.25X0.85MM_NO_SILK]
CLEAN384  M01PTH_SMD_3.25X0.85MM_NO_SILK  [1X01_SMD_3.25X0.85MM_NO_SILK]
CLEAN385  M01PTH_SMD_3.25X0.85MM_NO_SILK  [1X01_SMD_3.25X0.85MM_NO_SILK]
CLEAN386  M01PTH_SMD_3.25X0.85MM_NO_SILK  [1X01_SMD_3.25X0.85MM_NO_SILK]
CLEAN387  M01PTH_SMD_3.25X0.85MM_NO_SILK  [1X01_SMD_3.25X0.85MM_NO_SILK]
CLEAN388  M01PTH_SMD_3.25X0.85MM_NO_SILK  [1X01_SMD_3.25X0.85MM_NO_SILK]
CLEAN389  M01PTH_SMD_3.25X0.85MM_NO_SILK  [1X01_SMD_3.25X0.85MM_NO_SILK]
CLEAN390  M01PTH_SMD_3.25X0.85MM_NO_SILK  [1X01_SMD_3.25X0.85MM_NO_SILK]
CLEAN391  M01PTH_SMD_3.25X0.85MM_NO_SILK  [1X01_SMD_3.25X0.85MM_NO_SILK]
CLEAN392  M01PTH_SMD_3.25X0.85MM_NO_SILK  [1X01_SMD_3.25X0.85MM_NO_SILK]
CLEAN393  M01PTH_SMD_3.25X0.85MM_NO_SILK  [1X01_SMD_3.25X0.85MM_NO_SILK]
CLEAN394  M01PTH_SMD_3.25X0.85MM_NO_SILK  [1X01_SMD_3.25X0.85MM_NO_SILK]
CLEAN395  M01PTH_SMD_3.25X0.85MM_NO_SILK  [1X01_SMD_3.25X0.85MM_NO_SILK]
CLEAN396  M01PTH_SMD_3.25X0.85MM_NO_SILK  [1X01_SMD_3.25X0.85MM_NO_SILK]
CLEAN397  M01PTH_SMD_3.25X0.85MM_NO_SILK  [1X01_SMD_3.25X0.85MM_NO_SILK]
CLEAN398  M01PTH_SMD_3.25X0.85MM_NO_SILK  [1X01_SMD_3.25X0.85MM_NO_SILK]
CLEAN399  M01PTH_SMD_3.25X0.85MM_NO_SILK  [1X01_SMD_3.25X0.85MM_NO_SILK]
CLEAN400  M01PTH_SMD_3.25X0.85MM_NO_SILK  [1X01_SMD_3.25X0.85MM_NO_SILK]
CLEAN401  M01PTH_SMD_3.25X0.85MM_NO_SILK  [1X01_SMD_3.25X0.85MM_NO_SILK]
CLEAN402  M01PTH_SMD_3.25X0.85MM_NO_SILK  [1X01_SMD_3.25X0.85MM_NO_SILK]
CLEAN403  M01PTH_SMD_3.25X0.85MM_NO_SILK  [1X01_SMD_3.25X0.85MM_NO_SILK]
CLEAN404  M01PTH_SMD_3.25X0.85MM_NO_SILK  [1X01_SMD_3.25X0.85MM_NO_SILK]
CLEAN405  M01PTH_SMD_3.25X0.85MM_NO_SILK  [1X01_SMD_3.25X0.85MM_NO_SILK]
CLEAN406  M01PTH_SMD_3.25X0.85MM_NO_SILK  [1X01_SMD_3.25X0.85MM_NO_SILK]
CLEAN407  M01PTH_SMD_3.25X0.85MM_NO_SILK  [1X01_SMD_3.25X0.85MM_NO_SILK]
CLEAN408  M01PTH_SMD_3.25X0.85MM_NO_SILK  [1X01_SMD_3.25X0.85MM_NO_SILK]
CLEAN409  M01PTH_SMD_3.25X0.85MM_NO_SILK  [1X01_SMD_3.25X0.85MM_NO_SILK]
CLEAN410  M01PTH_SMD_3.25X0.85MM_NO_SILK  [1X01_SMD_3.25X0.85MM_NO_SILK]
CLEAN411  M01PTH_SMD_3.25X0.85MM_NO_SILK  [1X01_SMD_3.25X0.85MM_NO_SILK]
CLEAN412  M01PTH_SMD_3.25X0.85MM_NO_SILK  [1X01_SMD_3.25X0.85MM_NO_SILK]
CLEAN413  M01PTH_SMD_3.25X0.85MM_NO_SILK  [1X01_SMD_3.25X0.85MM_NO_SILK]
CLEAN414  M01PTH_SMD_3.25X0.85MM_NO_SILK  [1X01_SMD_3.25X0.85MM_NO_SILK]
CLEAN415  M01PTH_SMD_3.25X0.85MM_NO_SILK  [1X01_SMD_3.25X0.85MM_NO_SILK]
CLEAN416  M01PTH_SMD_3.25X0.85MM_NO_SILK  [1X01_SMD_3.25X0.85MM_NO_SILK]
CLEAN417  M01PTH_SMD_3.25X0.85MM_NO_SILK  [1X01_SMD_3.25X0.85MM_NO_SILK]
CLEAN418  M01PTH_SMD_3.25X0.85MM_NO_SILK  [1X01_SMD_3.25X0.85MM_NO_SILK]
CLEAN419  M01PTH_SMD_3.25X0.85MM_NO_SILK  [1X01_SMD_3.25X0.85MM_NO_SILK]
CLEAN420  M01PTH_SMD_3.25X0.85MM_NO_SILK  [1X01_SMD_3.25X0.85MM_NO_SILK]
CLEAN421  M01PTH_SMD_3.25X0.85MM_NO_SILK  [1X01_SMD_3.25X0.85MM_NO_SILK]
CLEAN422  M01PTH_SMD_3.25X0.85MM_NO_SILK  [1X01_SMD_3.25X0.85MM_NO_SILK]
CLEAN423  M01PTH_SMD_3.25X0.85MM_NO_SILK  [1X01_SMD_3.25X0.85MM_NO_SILK]
CLEAN424  M01PTH_SMD_3.25X0.85MM_NO_SILK  [1X01_SMD_3.25X0.85MM_NO_SILK]
CLEAN425  M01PTH_SMD_3.25X0.85MM_NO_SILK  [1X01_SMD_3.25X0.85MM_NO_SILK]
CLEAN426  M01PTH_SMD_3.25X0.85MM_NO_SILK  [1X01_SMD_3.25X0.85MM_NO_SILK]
CLEAN427  M01PTH_SMD_3.25X0.85MM_NO_SILK  [1X01_SMD_3.25X0.85MM_NO_SILK]
CLEAN428  M01PTH_SMD_3.25X0.85MM_NO_SILK  [1X01_SMD_3.25X0.85MM_NO_SILK]
CLEAN429  M01PTH_SMD_3.25X0.85MM_NO_SILK  [1X01_SMD_3.25X0.85MM_NO_SILK]
CLEAN430  M01PTH_SMD_3.25X0.85MM_NO_SILK  [1X01_SMD_3.25X0.85MM_NO_SILK]
CLEAN431  M01PTH_SMD_3.25X0.85MM_NO_SILK  [1X01_SMD_3.25X0.85MM_NO_SILK]
CLEAN432  M01PTH_SMD_3.25X0.85MM_NO_SILK  [1X01_SMD_3.25X0.85MM_NO_SILK]
CLEAN433  M01PTH_SMD_3.25X0.85MM_NO_SILK  [1X01_SMD_3.25X0.85MM_NO_SILK]
CLEAN434  M01PTH_SMD_3.25X0.85MM_NO_SILK  [1X01_SMD_3.25X0.85MM_NO_SILK]
CLEAN435  M01PTH_SMD_3.25X0.85MM_NO_SILK  [1X01_SMD_3.25X0.85MM_NO_SILK]
CLEAN436  M01PTH_SMD_3.25X0.85MM_NO_SILK  [1X01_SMD_3.25X0.85MM_NO_SILK]
CLEAN437  M01PTH_SMD_3.25X0.85MM_NO_SILK  [1X01_SMD_3.25X0.85MM_NO_SILK]
CLEAN438  M01PTH_SMD_3.25X0.85MM_NO_SILK  [1X01_SMD_3.25X0.85MM_NO_SILK]
CLEAN439  M01PTH_SMD_3.25X0.85MM_NO_SILK  [1X01_SMD_3.25X0.85MM_NO_SILK]
CLEAN440  M01PTH_SMD_3.25X0.85MM_NO_SILK  [1X01_SMD_3.25X0.85MM_NO_SILK]
CLEAN441  M01PTH_SMD_3.25X0.85MM_NO_SILK  [1X01_SMD_3.25X0.85MM_NO_SILK]
CLEAN442  M01PTH_SMD_3.25X0.85MM_NO_SILK  [1X01_SMD_3.25X0.85MM_NO_SILK]
CLEAN443  M01PTH_SMD_3.25X0.85MM_NO_SILK  [1X01_SMD_3.25X0.85MM_NO_SILK]
CLEAN444  M01PTH_SMD_3.25X0.85MM_NO_SILK  [1X01_SMD_3.25X0.85MM_NO_SILK]
CLEAN445  M01PTH_SMD_3.25X0.85MM_NO_SILK  [1X01_SMD_3.25X0.85MM_NO_SILK]
CLEAN446  M01PTH_SMD_3.25X0.85MM_NO_SILK  [1X01_SMD_3.25X0.85MM_NO_SILK]
CLEAN447  M01PTH_SMD_3.25X0.85MM_NO_SILK  [1X01_SMD_3.25X0.85MM_NO_SILK]
CLEAN448  M01PTH_SMD_3.25X0.85MM_NO_SILK  [1X01_SMD_3.25X0.85MM_NO_SILK]
CLEAN449  M01PTH_SMD_3.25X0.85MM_NO_SILK  [1X01_SMD_3.25X0.85MM_NO_SILK]
CLEAN450  M01PTH_SMD_3.25X0.85MM_NO_SILK  [1X01_SMD_3.25X0.85MM_NO_SILK]
CLEAN451  M01PTH_SMD_3.25X0.85MM_NO_SILK  [1X01_SMD_3.25X0.85MM_NO_SILK]
CLEAN452  M01PTH_SMD_3.25X0.85MM_NO_SILK  [1X01_SMD_3.25X0.85MM_NO_SILK]
CLEAN453  M01PTH_SMD_3.25X0.85MM_NO_SILK  [1X01_SMD_3.25X0.85MM_NO_SILK]
CLEAN454  M01PTH_SMD_3.25X0.85MM_NO_SILK  [1X01_SMD_3.25X0.85MM_NO_SILK]
CLEAN455  M01PTH_SMD_3.25X0.85MM_NO_SILK  [1X01_SMD_3.25X0.85MM_NO_SILK]
CLEAN456  M01PTH_SMD_3.25X0.85MM_NO_SILK  [1X01_SMD_3.25X0.85MM_NO_SILK]
CLEAN457  M01PTH_SMD_3.25X0.85MM_NO_SILK  [1X01_SMD_3.25X0.85MM_NO_SILK]
CLEAN458  M01PTH_SMD_3.25X0.85MM_NO_SILK  [1X01_SMD_3.25X0.85MM_NO_SILK]
CLEAN459  M01PTH_SMD_3.25X0.85MM_NO_SILK  [1X01_SMD_3.25X0.85MM_NO_SILK]
CLEAN460  M01PTH_SMD_3.25X0.85MM_NO_SILK  [1X01_SMD_3.25X0.85MM_NO_SILK]
CLEAN461  M01PTH_SMD_3.25X0.85MM_NO_SILK  [1X01_SMD_3.25X0.85MM_NO_SILK]
CLEAN462  M01PTH_SMD_3.25X0.85MM_NO_SILK  [1X01_SMD_3.25X0.85MM_NO_SILK]
CLEAN463  M01PTH_SMD_3.25X0.85MM_NO_SILK  [1X01_SMD_3.25X0.85MM_NO_SILK]
CLEAN464  M01PTH_SMD_3.25X0.85MM_NO_SILK  [1X01_SMD_3.25X0.85MM_NO_SILK]
CLEAN465  M01PTH_SMD_3.25X0.85MM_NO_SILK  [1X01_SMD_3.25X0.85MM_NO_SILK]
CLEAN466  M01PTH_SMD_3.25X0.85MM_NO_SILK  [1X01_SMD_3.25X0.85MM_NO_SILK]
CLEAN467  M01PTH_SMD_3.25X0.85MM_NO_SILK  [1X01_SMD_3.25X0.85MM_NO_SILK]
CLEAN468  M01PTH_SMD_3.25X0.85MM_NO_SILK  [1X01_SMD_3.25X0.85MM_NO_SILK]
CLEAN469  M01PTH_SMD_3.25X0.85MM_NO_SILK  [1X01_SMD_3.25X0.85MM_NO_SILK]
CLEAN470  M01PTH_SMD_3.25X0.85MM_NO_SILK  [1X01_SMD_3.25X0.85MM_NO_SILK]
CLEAN471  M01PTH_SMD_3.25X0.85MM_NO_SILK  [1X01_SMD_3.25X0.85MM_NO_SILK]
CLEAN472  M01PTH_SMD_3.25X0.85MM_NO_SILK  [1X01_SMD_3.25X0.85MM_NO_SILK]
CLEAN473  M01PTH_SMD_3.25X0.85MM_NO_SILK  [1X01_SMD_3.25X0.85MM_NO_SILK]
CLEAN474  M01PTH_SMD_3.25X0.85MM_NO_SILK  [1X01_SMD_3.25X0.85MM_NO_SILK]
CLEAN475  M01PTH_SMD_3.25X0.85MM_NO_SILK  [1X01_SMD_3.25X0.85MM_NO_SILK]
CLEAN476  M01PTH_SMD_3.25X0.85MM_NO_SILK  [1X01_SMD_3.25X0.85MM_NO_SILK]
CLEAN477  M01PTH_SMD_3.25X0.85MM_NO_SILK  [1X01_SMD_3.25X0.85MM_NO_SILK]
CLEAN478  M01PTH_SMD_3.25X0.85MM_NO_SILK  [1X01_SMD_3.25X0.85MM_NO_SILK]
CLEAN479  M01PTH_SMD_3.25X0.85MM_NO_SILK  [1X01_SMD_3.25X0.85MM_NO_SILK]
CLEAN480  M01PTH_SMD_3.25X0.85MM_NO_SILK  [1X01_SMD_3.25X0.85MM_NO_SILK]
CLEAN481  M01PTH_SMD_3.25X0.85MM_NO_SILK  [1X01_SMD_3.25X0.85MM_NO_SILK]
CLEAN482  M01PTH_SMD_3.25X0.85MM_NO_SILK  [1X01_SMD_3.25X0.85MM_NO_SILK]
CLEAN483  M01PTH_SMD_3.25X0.85MM_NO_SILK  [1X01_SMD_3.25X0.85MM_NO_SILK]
CLEAN484  M01PTH_SMD_3.25X0.85MM_NO_SILK  [1X01_SMD_3.25X0.85MM_NO_SILK]
CLEAN485  M01PTH_SMD_3.25X0.85MM_NO_SILK  [1X01_SMD_3.25X0.85MM_NO_SILK]
CLEAN486  M01PTH_SMD_3.25X0.85MM_NO_SILK  [1X01_SMD_3.25X0.85MM_NO_SILK]
CLEAN487  M01PTH_SMD_3.25X0.85MM_NO_SILK  [1X01_SMD_3.25X0.85MM_NO_SILK]
CLEAN488  M01PTH_SMD_3.25X0.85MM_NO_SILK  [1X01_SMD_3.25X0.85MM_NO_SILK]
CLEAN489  M01PTH_SMD_3.25X0.85MM_NO_SILK  [1X01_SMD_3.25X0.85MM_NO_SILK]
CLEAN490  M01PTH_SMD_3.25X0.85MM_NO_SILK  [1X01_SMD_3.25X0.85MM_NO_SILK]
CLEAN491  M01PTH_SMD_3.25X0.85MM_NO_SILK  [1X01_SMD_3.25X0.85MM_NO_SILK]
CLEAN492  M01PTH_SMD_3.25X0.85MM_NO_SILK  [1X01_SMD_3.25X0.85MM_NO_SILK]
CLEAN493  M01PTH_SMD_3.25X0.85MM_NO_SILK  [1X01_SMD_3.25X0.85MM_NO_SILK]
CLEAN494  M01PTH_SMD_3.25X0.85MM_NO_SILK  [1X01_SMD_3.25X0.85MM_NO_SILK]
CLEAN495  M01PTH_SMD_3.25X0.85MM_NO_SILK  [1X01_SMD_3.25X0.85MM_NO_SILK]
CLEAN496  M01PTH_SMD_3.25X0.85MM_NO_SILK  [1X01_SMD_3.25X0.85MM_NO_SILK]
CLEAN497  M01PTH_SMD_3.25X0.85MM_NO_SILK  [1X01_SMD_3.25X0.85MM_NO_SILK]
CLEAN498  M01PTH_SMD_3.25X0.85MM_NO_SILK  [1X01_SMD_3.25X0.85MM_NO_SILK]
CLEAN499  M01PTH_SMD_3.25X0.85MM_NO_SILK  [1X01_SMD_3.25X0.85MM_NO_SILK]
CLEAN500  M01PTH_SMD_3.25X0.85MM_NO_SILK  [1X01_SMD_3.25X0.85MM_NO_SILK]
CLEAN501  M01PTH_SMD_3.25X0.85MM_NO_SILK  [1X01_SMD_3.25X0.85MM_NO_SILK]
CLEAN502  M01PTH_SMD_3.25X0.85MM_NO_SILK  [1X01_SMD_3.25X0.85MM_NO_SILK]
CLEAN503  M01PTH_SMD_3.25X0.85MM_NO_SILK  [1X01_SMD_3.25X0.85MM_NO_SILK]
CLEAN504  M01PTH_SMD_3.25X0.85MM_NO_SILK  [1X01_SMD_3.25X0.85MM_NO_SILK]
CLEAN505  M01PTH_SMD_3.25X0.85MM_NO_SILK  [1X01_SMD_3.25X0.85MM_NO_SILK]
CLEAN506  M01PTH_SMD_3.25X0.85MM_NO_SILK  [1X01_SMD_3.25X0.85MM_NO_SILK]
CLEAN507  M01PTH_SMD_3.25X0.85MM_NO_SILK  [1X01_SMD_3.25X0.85MM_NO_SILK]
CLEAN508  M01PTH_SMD_3.25X0.85MM_NO_SILK  [1X01_SMD_3.25X0.85MM_NO_SILK]
CLEAN509  M01PTH_SMD_3.25X0.85MM_NO_SILK  [1X01_SMD_3.25X0.85MM_NO_SILK]
CLEAN510  M01PTH_SMD_3.25X0.85MM_NO_SILK  [1X01_SMD_3.25X0.85MM_NO_SILK]
CLEAN511  M01PTH_SMD_3.25X0.85MM_NO_SILK  [1X01_SMD_3.25X0.85MM_NO_SILK]
CLEAN512  M01PTH_SMD_3.25X0.85MM_NO_SILK  [1X01_SMD_3.25X0.85MM_NO_SILK]
CLEAN513  M01PTH_SMD_3.25X0.85MM_NO_SILK  [1X01_SMD_3.25X0.85MM_NO_SILK]
CLEAN514  M01PTH_SMD_3.25X0.85MM_NO_SILK  [1X01_SMD_3.25X0.85MM_NO_SILK]
CLEAN515  M01PTH_SMD_3.25X0.85MM_NO_SILK  [1X01_SMD_3.25X0.85MM_NO_SILK]
CLEAN516  M01PTH_SMD_3.25X0.85MM_NO_SILK  [1X01_SMD_3.25X0.85MM_NO_SILK]
CLEAN517  M01PTH_SMD_3.25X0.85MM_NO_SILK  [1X01_SMD_3.25X0.85MM_NO_SILK]
CLEAN518  M01PTH_SMD_3.25X0.85MM_NO_SILK  [1X01_SMD_3.25X0.85MM_NO_SILK]
CLEAN519  M01PTH_SMD_3.25X0.85MM_NO_SILK  [1X01_SMD_3.25X0.85MM_NO_SILK]
CLEAN520  M01PTH_SMD_3.25X0.85MM_NO_SILK  [1X01_SMD_3.25X0.85MM_NO_SILK]
CLEAN521  M01PTH_SMD_3.25X0.85MM_NO_SILK  [1X01_SMD_3.25X0.85MM_NO_SILK]
CLEAN522  M01PTH_SMD_3.25X0.85MM_NO_SILK  [1X01_SMD_3.25X0.85MM_NO_SILK]
CLEAN523  M01PTH_SMD_3.25X0.85MM_NO_SILK  [1X01_SMD_3.25X0.85MM_NO_SILK]
CLEAN524  M01PTH_SMD_3.25X0.85MM_NO_SILK  [1X01_SMD_3.25X0.85MM_NO_SILK]
CLEAN525  M01PTH_SMD_3.25X0.85MM_NO_SILK  [1X01_SMD_3.25X0.85MM_NO_SILK]
CLEAN526  M01PTH_SMD_3.25X0.85MM_NO_SILK  [1X01_SMD_3.25X0.85MM_NO_SILK]
CLEAN527  M01PTH_SMD_3.25X0.85MM_NO_SILK  [1X01_SMD_3.25X0.85MM_NO_SILK]
CLEAN528  M01PTH_SMD_3.25X0.85MM_NO_SILK  [1X01_SMD_3.25X0.85MM_NO_SILK]
CLEAN529  M01PTH_SMD_3.25X0.85MM_NO_SILK  [1X01_SMD_3.25X0.85MM_NO_SILK]
CLEAN530  M01PTH_SMD_3.25X0.85MM_NO_SILK  [1X01_SMD_3.25X0.85MM_NO_SILK]
CLEAN531  M01PTH_SMD_3.25X0.85MM_NO_SILK  [1X01_SMD_3.25X0.85MM_NO_SILK]
CLEAN532  M01PTH_SMD_3.25X0.85MM_NO_SILK  [1X01_SMD_3.25X0.85MM_NO_SILK]
CLEAN533  M01PTH_SMD_3.25X0.85MM_NO_SILK  [1X01_SMD_3.25X0.85MM_NO_SILK]
CLEAN534  M01PTH_SMD_3.25X0.85MM_NO_SILK  [1X01_SMD_3.25X0.85MM_NO_SILK]
CLEAN535  M01PTH_SMD_3.25X0.85MM_NO_SILK  [1X01_SMD_3.25X0.85MM_NO_SILK]
CLEAN536  M01PTH_SMD_3.25X0.85MM_NO_SILK  [1X01_SMD_3.25X0.85MM_NO_SILK]
CLEAN537  M01PTH_SMD_3.25X0.85MM_NO_SILK  [1X01_SMD_3.25X0.85MM_NO_SILK]
CLEAN538  M01PTH_SMD_3.25X0.85MM_NO_SILK  [1X01_SMD_3.25X0.85MM_NO_SILK]
CLEAN539  M01PTH_SMD_3.25X0.85MM_NO_SILK  [1X01_SMD_3.25X0.85MM_NO_SILK]
CLEAN540  M01PTH_SMD_3.25X0.85MM_NO_SILK  [1X01_SMD_3.25X0.85MM_NO_SILK]
CLEAN541  M01PTH_SMD_3.25X0.85MM_NO_SILK  [1X01_SMD_3.25X0.85MM_NO_SILK]
CLEAN542  M01PTH_SMD_3.25X0.85MM_NO_SILK  [1X01_SMD_3.25X0.85MM_NO_SILK]
CLEAN543  M01PTH_SMD_3.25X0.85MM_NO_SILK  [1X01_SMD_3.25X0.85MM_NO_SILK]
CLEAN544  M01PTH_SMD_3.25X0.85MM_NO_SILK  [1X01_SMD_3.25X0.85MM_NO_SILK]
CLEAN545  M01PTH_SMD_3.25X0.85MM_NO_SILK  [1X01_SMD_3.25X0.85MM_NO_SILK]
CLEAN546  M01PTH_SMD_3.25X0.85MM_NO_SILK  [1X01_SMD_3.25X0.85MM_NO_SILK]
CLEAN547  M01PTH_SMD_3.25X0.85MM_NO_SILK  [1X01_SMD_3.25X0.85MM_NO_SILK]
CLEAN548  M01PTH_SMD_3.25X0.85MM_NO_SILK  [1X01_SMD_3.25X0.85MM_NO_SILK]
CLEAN549  M01PTH_SMD_3.25X0.85MM_NO_SILK  [1X01_SMD_3.25X0.85MM_NO_SILK]
CLEAN550  M01PTH_SMD_3.25X0.85MM_NO_SILK  [1X01_SMD_3.25X0.85MM_NO_SILK]
CLEAN551  M01PTH_SMD_3.25X0.85MM_NO_SILK  [1X01_SMD_3.25X0.85MM_NO_SILK]
CLEAN552  M01PTH_SMD_3.25X0.85MM_NO_SILK  [1X01_SMD_3.25X0.85MM_NO_SILK]
CLEAN553  M01PTH_SMD_3.25X0.85MM_NO_SILK  [1X01_SMD_3.25X0.85MM_NO_SILK]
CLEAN554  M01PTH_SMD_3.25X0.85MM_NO_SILK  [1X01_SMD_3.25X0.85MM_NO_SILK]
CLEAN555  M01PTH_SMD_3.25X0.85MM_NO_SILK  [1X01_SMD_3.25X0.85MM_NO_SILK]
CLEAN556  M01PTH_SMD_3.25X0.85MM_NO_SILK  [1X01_SMD_3.25X0.85MM_NO_SILK]
CLEAN557  M01PTH_SMD_3.25X0.85MM_NO_SILK  [1X01_SMD_3.25X0.85MM_NO_SILK]
CLEAN558  M01PTH_SMD_3.25X0.85MM_NO_SILK  [1X01_SMD_3.25X0.85MM_NO_SILK]
CLEAN559  M01PTH_SMD_3.25X0.85MM_NO_SILK  [1X01_SMD_3.25X0.85MM_NO_SILK]
CLEAN560  M01PTH_SMD_3.25X0.85MM_NO_SILK  [1X01_SMD_3.25X0.85MM_NO_SILK]
CLEAN561  M01PTH_SMD_3.25X0.85MM_NO_SILK  [1X01_SMD_3.25X0.85MM_NO_SILK]
CLEAN562  M01PTH_SMD_3.25X0.85MM_NO_SILK  [1X01_SMD_3.25X0.85MM_NO_SILK]
CLEAN563  M01PTH_SMD_3.25X0.85MM_NO_SILK  [1X01_SMD_3.25X0.85MM_NO_SILK]
CLEAN564  M01PTH_SMD_3.25X0.85MM_NO_SILK  [1X01_SMD_3.25X0.85MM_NO_SILK]
CLEAN565  M01PTH_SMD_3.25X0.85MM_NO_SILK  [1X01_SMD_3.25X0.85MM_NO_SILK]
CLEAN566  M01PTH_SMD_3.25X0.85MM_NO_SILK  [1X01_SMD_3.25X0.85MM_NO_SILK]
CLEAN567  M01PTH_SMD_3.25X0.85MM_NO_SILK  [1X01_SMD_3.25X0.85MM_NO_SILK]
CLEAN568  M01PTH_SMD_3.25X0.85MM_NO_SILK  [1X01_SMD_3.25X0.85MM_NO_SILK]
CLEAN569  M01PTH_SMD_3.25X0.85MM_NO_SILK  [1X01_SMD_3.25X0.85MM_NO_SILK]
CLEAN570  M01PTH_SMD_3.25X0.85MM_NO_SILK  [1X01_SMD_3.25X0.85MM_NO_SILK]
CLEAN571  M01PTH_SMD_3.25X0.85MM_NO_SILK  [1X01_SMD_3.25X0.85MM_NO_SILK]
CLEAN572  M01PTH_SMD_3.25X0.85MM_NO_SILK  [1X01_SMD_3.25X0.85MM_NO_SILK]
CLEAN573  M01PTH_SMD_3.25X0.85MM_NO_SILK  [1X01_SMD_3.25X0.85MM_NO_SILK]
CLEAN574  M01PTH_SMD_3.25X0.85MM_NO_SILK  [1X01_SMD_3.25X0.85MM_NO_SILK]
CLEAN575  M01PTH_SMD_3.25X0.85MM_NO_SILK  [1X01_SMD_3.25X0.85MM_NO_SILK]
CLEAN576  M01PTH_SMD_3.25X0.85MM_NO_SILK  [1X01_SMD_3.25X0.85MM_NO_SILK]
CLEAN577  M01PTH_SMD_3.25X0.85MM_NO_SILK  [1X01_SMD_3.25X0.85MM_NO_SILK]
CLEAN578  M01PTH_SMD_3.25X0.85MM_NO_SILK  [1X01_SMD_3.25X0.85MM_NO_SILK]
CLEAN579  M01PTH_SMD_3.25X0.85MM_NO_SILK  [1X01_SMD_3.25X0.85MM_NO_SILK]
CLEAN580  M01PTH_SMD_3.25X0.85MM_NO_SILK  [1X01_SMD_3.25X0.85MM_NO_SILK]
CLEAN581  M01PTH_SMD_3.25X0.85MM_NO_SILK  [1X01_SMD_3.25X0.85MM_NO_SILK]
CLEAN582  M01PTH_SMD_3.25X0.85MM_NO_SILK  [1X01_SMD_3.25X0.85MM_NO_SILK]
CLEAN583  M01PTH_SMD_3.25X0.85MM_NO_SILK  [1X01_SMD_3.25X0.85MM_NO_SILK]
CLEAN584  M01PTH_SMD_3.25X0.85MM_NO_SILK  [1X01_SMD_3.25X0.85MM_NO_SILK]
CLEAN585  M01PTH_SMD_3.25X0.85MM_NO_SILK  [1X01_SMD_3.25X0.85MM_NO_SILK]
CLEAN586  M01PTH_SMD_3.25X0.85MM_NO_SILK  [1X01_SMD_3.25X0.85MM_NO_SILK]
CLEAN587  M01PTH_SMD_3.25X0.85MM_NO_SILK  [1X01_SMD_3.25X0.85MM_NO_SILK]
CLEAN588  M01PTH_SMD_3.25X0.85MM_NO_SILK  [1X01_SMD_3.25X0.85MM_NO_SILK]
CLEAN589  M01PTH_SMD_3.25X0.85MM_NO_SILK  [1X01_SMD_3.25X0.85MM_NO_SILK]
CLEAN590  M01PTH_SMD_3.25X0.85MM_NO_SILK  [1X01_SMD_3.25X0.85MM_NO_SILK]
CLEAN591  M01PTH_SMD_3.25X0.85MM_NO_SILK  [1X01_SMD_3.25X0.85MM_NO_SILK]
CLEAN592  M01PTH_SMD_3.25X0.85MM_NO_SILK  [1X01_SMD_3.25X0.85MM_NO_SILK]
CLEAN593  M01PTH_SMD_3.25X0.85MM_NO_SILK  [1X01_SMD_3.25X0.85MM_NO_SILK]
CLEAN594  M01PTH_SMD_3.25X0.85MM_NO_SILK  [1X01_SMD_3.25X0.85MM_NO_SILK]
CLEAN595  M01PTH_SMD_3.25X0.85MM_NO_SILK  [1X01_SMD_3.25X0.85MM_NO_SILK]
CLEAN596  M01PTH_SMD_3.25X0.85MM_NO_SILK  [1X01_SMD_3.25X0.85MM_NO_SILK]
CLEAN597  M01PTH_SMD_3.25X0.85MM_NO_SILK  [1X01_SMD_3.25X0.85MM_NO_SILK]
CLEAN598  M01PTH_SMD_3.25X0.85MM_NO_SILK  [1X01_SMD_3.25X0.85MM_NO_SILK]
CLEAN599  M01PTH_SMD_3.25X0.85MM_NO_SILK  [1X01_SMD_3.25X0.85MM_NO_SILK]

## Nets
NEW_0: CLEAN6.1 CLEAN360.P$3
NEW_1: CLEAN7.1 CLEAN361.P$3
NEW_2: CLEAN16.1 CLEAN362.P$3
NEW_3: CLEAN17.1 CLEAN363.P$3
NEW_4: CLEAN26.1 CLEAN364.P$3
NEW_5: CLEAN27.1 CLEAN365.P$3
NEW_6: CLEAN36.1 CLEAN366.P$3
NEW_7: CLEAN37.1 CLEAN367.P$3
NEW_8: CLEAN46.1 CLEAN368.P$3
NEW_9: CLEAN47.1 CLEAN369.P$3
NEW_10: CLEAN56.1 CLEAN370.P$3
NEW_11: CLEAN57.1 CLEAN371.P$3
NEW_12: CLEAN66.1 CLEAN372.P$3
NEW_13: CLEAN67.1 CLEAN373.P$3
NEW_14: CLEAN76.1 CLEAN374.P$3
NEW_15: CLEAN77.1 CLEAN375.P$3
NEW_16: CLEAN86.1 CLEAN376.P$3
NEW_17: CLEAN87.1 CLEAN377.P$3
NEW_18: CLEAN96.1 CLEAN378.P$3
NEW_19: CLEAN97.1 CLEAN379.P$3
NEW_20: CLEAN106.1 CLEAN380.P$3
NEW_21: CLEAN107.1 CLEAN381.P$3
NEW_22: CLEAN116.1 CLEAN382.P$3
NEW_23: CLEAN117.1 CLEAN383.P$3
NEW_24: CLEAN126.1 CLEAN384.P$3
NEW_25: CLEAN127.1 CLEAN385.P$3
NEW_26: CLEAN136.1 CLEAN386.P$3
NEW_27: CLEAN137.1 CLEAN387.P$3
NEW_28: CLEAN146.1 CLEAN388.P$3
NEW_29: CLEAN147.1 CLEAN389.P$3
NEW_30: CLEAN156.1 CLEAN390.P$3
NEW_31: CLEAN157.1 CLEAN391.P$3
NEW_32: CLEAN166.1 CLEAN392.P$3
NEW_33: CLEAN167.1 CLEAN393.P$3
NEW_34: CLEAN176.1 CLEAN394.P$3
NEW_35: CLEAN177.1 CLEAN395.P$3
NEW_36: CLEAN186.1 CLEAN396.P$3
NEW_37: CLEAN187.1 CLEAN397.P$3
NEW_38: CLEAN196.1 CLEAN398.P$3
NEW_39: CLEAN197.1 CLEAN399.P$3
NEW_40: CLEAN206.1 CLEAN400.P$3
NEW_41: CLEAN207.1 CLEAN401.P$3
NEW_42: CLEAN216.1 CLEAN402.P$3
NEW_43: CLEAN217.1 CLEAN403.P$3
NEW_44: CLEAN226.1 CLEAN404.P$3
NEW_45: CLEAN227.1 CLEAN405.P$3
NEW_46: CLEAN236.1 CLEAN406.P$3
NEW_47: CLEAN237.1 CLEAN407.P$3
NEW_48: CLEAN246.1 CLEAN408.P$3
NEW_49: CLEAN247.1 CLEAN409.P$3
NEW_50: CLEAN256.1 CLEAN410.P$3
NEW_51: CLEAN257.1 CLEAN411.P$3
NEW_52: CLEAN266.1 CLEAN412.P$3
NEW_53: CLEAN267.1 CLEAN413.P$3
NEW_54: CLEAN276.1 CLEAN414.P$3
NEW_55: CLEAN277.1 CLEAN415.P$3
NEW_56: CLEAN286.1 CLEAN416.P$3
NEW_57: CLEAN287.1 CLEAN417.P$3
NEW_58: CLEAN296.1 CLEAN418.P$3
NEW_59: CLEAN297.1 CLEAN419.P$3
NEW_60: CLEAN8.1 CLEAN420.P$3
NEW_61: CLEAN9.1 CLEAN421.P$3
NEW_62: CLEAN18.1 CLEAN422.P$3
NEW_63: CLEAN19.1 CLEAN423.P$3
NEW_64: CLEAN28.1 CLEAN424.P$3
NEW_65: CLEAN29.1 CLEAN425.P$3
NEW_66: CLEAN38.1 CLEAN426.P$3
NEW_67: CLEAN39.1 CLEAN427.P$3
NEW_68: CLEAN48.1 CLEAN428.P$3
NEW_69: CLEAN49.1 CLEAN429.P$3
NEW_70: CLEAN58.1 CLEAN430.P$3
NEW_71: CLEAN59.1 CLEAN431.P$3
NEW_72: CLEAN68.1 CLEAN432.P$3
NEW_73: CLEAN69.1 CLEAN433.P$3
NEW_74: CLEAN78.1 CLEAN434.P$3
NEW_75: CLEAN79.1 CLEAN435.P$3
NEW_76: CLEAN88.1 CLEAN436.P$3
NEW_77: CLEAN89.1 CLEAN437.P$3
NEW_78: CLEAN98.1 CLEAN438.P$3
NEW_79: CLEAN99.1 CLEAN439.P$3
NEW_80: CLEAN108.1 CLEAN440.P$3
NEW_81: CLEAN109.1 CLEAN441.P$3
NEW_82: CLEAN118.1 CLEAN442.P$3
NEW_83: CLEAN119.1 CLEAN443.P$3
NEW_84: CLEAN128.1 CLEAN444.P$3
NEW_85: CLEAN129.1 CLEAN445.P$3
NEW_86: CLEAN138.1 CLEAN446.P$3
NEW_87: CLEAN139.1 CLEAN447.P$3
NEW_88: CLEAN148.1 CLEAN448.P$3
NEW_89: CLEAN149.1 CLEAN449.P$3
NEW_90: CLEAN158.1 CLEAN450.P$3
NEW_91: CLEAN159.1 CLEAN451.P$3
NEW_92: CLEAN168.1 CLEAN452.P$3
NEW_93: CLEAN169.1 CLEAN453.P$3
NEW_94: CLEAN178.1 CLEAN454.P$3
NEW_95: CLEAN179.1 CLEAN455.P$3
NEW_96: CLEAN188.1 CLEAN456.P$3
NEW_97: CLEAN189.1 CLEAN457.P$3
NEW_98: CLEAN198.1 CLEAN458.P$3
NEW_99: CLEAN199.1 CLEAN459.P$3
NEW_100: CLEAN208.1 CLEAN460.P$3
NEW_101: CLEAN209.1 CLEAN461.P$3
NEW_102: CLEAN218.1 CLEAN462.P$3
NEW_103: CLEAN219.1 CLEAN463.P$3
NEW_104: CLEAN228.1 CLEAN464.P$3
NEW_105: CLEAN229.1 CLEAN465.P$3
NEW_106: CLEAN238.1 CLEAN466.P$3
NEW_107: CLEAN239.1 CLEAN467.P$3
NEW_108: CLEAN248.1 CLEAN468.P$3
NEW_109: CLEAN249.1 CLEAN469.P$3
NEW_110: CLEAN258.1 CLEAN470.P$3
NEW_111: CLEAN259.1 CLEAN471.P$3
NEW_112: CLEAN268.1 CLEAN472.P$3
NEW_113: CLEAN269.1 CLEAN473.P$3
NEW_114: CLEAN278.1 CLEAN474.P$3
NEW_115: CLEAN279.1 CLEAN475.P$3
NEW_116: CLEAN288.1 CLEAN476.P$3
NEW_117: CLEAN289.1 CLEAN477.P$3
NEW_118: CLEAN298.1 CLEAN478.P$3
NEW_119: CLEAN299.1 CLEAN479.P$3
NEW_120: CLEAN0.1 CLEAN300.P$3
NEW_121: CLEAN1.1 CLEAN301.P$3
NEW_122: CLEAN10.1 CLEAN302.P$3
NEW_123: CLEAN11.1 CLEAN303.P$3
NEW_124: CLEAN20.1 CLEAN304.P$3
NEW_125: CLEAN21.1 CLEAN305.P$3
NEW_126: CLEAN30.1 CLEAN306.P$3
NEW_127: CLEAN31.1 CLEAN307.P$3
NEW_128: CLEAN40.1 CLEAN308.P$3
NEW_129: CLEAN41.1 CLEAN309.P$3
NEW_130: CLEAN50.1 CLEAN310.P$3
NEW_131: CLEAN51.1 CLEAN311.P$3
NEW_132: CLEAN60.1 CLEAN312.P$3
NEW_133: CLEAN61.1 CLEAN313.P$3
NEW_134: CLEAN70.1 CLEAN314.P$3
NEW_135: CLEAN71.1 CLEAN315.P$3
NEW_136: CLEAN80.1 CLEAN316.P$3
NEW_137: CLEAN81.1 CLEAN317.P$3
NEW_138: CLEAN90.1 CLEAN318.P$3
NEW_139: CLEAN91.1 CLEAN319.P$3
NEW_140: CLEAN100.1 CLEAN320.P$3
NEW_141: CLEAN101.1 CLEAN321.P$3
NEW_142: CLEAN110.1 CLEAN322.P$3
NEW_143: CLEAN111.1 CLEAN323.P$3
NEW_144: CLEAN120.1 CLEAN324.P$3
NEW_145: CLEAN121.1 CLEAN325.P$3
NEW_146: CLEAN130.1 CLEAN326.P$3
NEW_147: CLEAN131.1 CLEAN327.P$3
NEW_148: CLEAN140.1 CLEAN328.P$3
NEW_149: CLEAN141.1 CLEAN329.P$3
NEW_150: CLEAN150.1 CLEAN330.P$3
NEW_151: CLEAN151.1 CLEAN331.P$3
NEW_152: CLEAN160.1 CLEAN332.P$3
NEW_153: CLEAN161.1 CLEAN333.P$3
NEW_154: CLEAN170.1 CLEAN334.P$3
NEW_155: CLEAN171.1 CLEAN335.P$3
NEW_156: CLEAN180.1 CLEAN336.P$3
NEW_157: CLEAN181.1 CLEAN337.P$3
NEW_158: CLEAN190.1 CLEAN338.P$3
NEW_159: CLEAN191.1 CLEAN339.P$3
NEW_160: CLEAN200.1 CLEAN340.P$3
NEW_161: CLEAN201.1 CLEAN341.P$3
NEW_162: CLEAN210.1 CLEAN342.P$3
NEW_163: CLEAN211.1 CLEAN343.P$3
NEW_164: CLEAN220.1 CLEAN344.P$3
NEW_165: CLEAN221.1 CLEAN345.P$3
NEW_166: CLEAN230.1 CLEAN346.P$3
NEW_167: CLEAN231.1 CLEAN347.P$3
NEW_168: CLEAN240.1 CLEAN348.P$3
NEW_169: CLEAN241.1 CLEAN349.P$3
NEW_170: CLEAN250.1 CLEAN350.P$3
NEW_171: CLEAN251.1 CLEAN351.P$3
NEW_172: CLEAN260.1 CLEAN352.P$3
NEW_173: CLEAN261.1 CLEAN353.P$3
NEW_174: CLEAN270.1 CLEAN354.P$3
NEW_175: CLEAN271.1 CLEAN355.P$3
NEW_176: CLEAN280.1 CLEAN356.P$3
NEW_177: CLEAN281.1 CLEAN357.P$3
NEW_178: CLEAN290.1 CLEAN358.P$3
NEW_179: CLEAN291.1 CLEAN359.P$3
NEW_180: CLEAN2.1 CLEAN480.P$3
NEW_181: CLEAN3.1 CLEAN481.P$3
NEW_182: CLEAN12.1 CLEAN482.P$3
NEW_183: CLEAN13.1 CLEAN483.P$3
NEW_184: CLEAN22.1 CLEAN484.P$3
NEW_185: CLEAN23.1 CLEAN485.P$3
NEW_186: CLEAN32.1 CLEAN486.P$3
NEW_187: CLEAN33.1 CLEAN487.P$3
NEW_188: CLEAN42.1 CLEAN488.P$3
NEW_189: CLEAN43.1 CLEAN489.P$3
NEW_190: CLEAN52.1 CLEAN490.P$3
NEW_191: CLEAN53.1 CLEAN491.P$3
NEW_192: CLEAN62.1 CLEAN492.P$3
NEW_193: CLEAN63.1 CLEAN493.P$3
NEW_194: CLEAN72.1 CLEAN494.P$3
NEW_195: CLEAN73.1 CLEAN495.P$3
NEW_196: CLEAN82.1 CLEAN496.P$3
NEW_197: CLEAN83.1 CLEAN497.P$3
NEW_198: CLEAN92.1 CLEAN498.P$3
NEW_199: CLEAN93.1 CLEAN499.P$3
NEW_200: CLEAN102.1 CLEAN500.P$3
NEW_201: CLEAN103.1 CLEAN501.P$3
NEW_202: CLEAN112.1 CLEAN502.P$3
NEW_203: CLEAN113.1 CLEAN503.P$3
NEW_204: CLEAN122.1 CLEAN504.P$3
NEW_205: CLEAN123.1 CLEAN505.P$3
NEW_206: CLEAN132.1 CLEAN506.P$3
NEW_207: CLEAN133.1 CLEAN507.P$3
NEW_208: CLEAN142.1 CLEAN508.P$3
NEW_209: CLEAN143.1 CLEAN509.P$3
NEW_210: CLEAN152.1 CLEAN510.P$3
NEW_211: CLEAN153.1 CLEAN511.P$3
NEW_212: CLEAN162.1 CLEAN512.P$3
NEW_213: CLEAN163.1 CLEAN513.P$3
NEW_214: CLEAN172.1 CLEAN514.P$3
NEW_215: CLEAN173.1 CLEAN515.P$3
NEW_216: CLEAN182.1 CLEAN516.P$3
NEW_217: CLEAN183.1 CLEAN517.P$3
NEW_218: CLEAN192.1 CLEAN518.P$3
NEW_219: CLEAN193.1 CLEAN519.P$3
NEW_220: CLEAN202.1 CLEAN520.P$3
NEW_221: CLEAN203.1 CLEAN521.P$3
NEW_222: CLEAN212.1 CLEAN522.P$3
NEW_223: CLEAN213.1 CLEAN523.P$3
NEW_224: CLEAN222.1 CLEAN524.P$3
NEW_225: CLEAN223.1 CLEAN525.P$3
NEW_226: CLEAN232.1 CLEAN526.P$3
NEW_227: CLEAN233.1 CLEAN527.P$3
NEW_228: CLEAN242.1 CLEAN528.P$3
NEW_229: CLEAN243.1 CLEAN529.P$3
NEW_230: CLEAN252.1 CLEAN530.P$3
NEW_231: CLEAN253.1 CLEAN531.P$3
NEW_232: CLEAN262.1 CLEAN532.P$3
NEW_233: CLEAN263.1 CLEAN533.P$3
NEW_234: CLEAN272.1 CLEAN534.P$3
NEW_235: CLEAN273.1 CLEAN535.P$3
NEW_236: CLEAN282.1 CLEAN536.P$3
NEW_237: CLEAN283.1 CLEAN537.P$3
NEW_238: CLEAN292.1 CLEAN538.P$3
NEW_239: CLEAN293.1 CLEAN539.P$3
NEW_240: CLEAN4.1 CLEAN560.P$3
NEW_241: CLEAN14.1 CLEAN561.P$3
NEW_242: CLEAN24.1 CLEAN562.P$3
NEW_243: CLEAN34.1 CLEAN563.P$3
NEW_244: CLEAN44.1 CLEAN564.P$3
NEW_245: CLEAN54.1 CLEAN565.P$3
NEW_246: CLEAN64.1 CLEAN566.P$3
NEW_247: CLEAN74.1 CLEAN567.P$3
NEW_248: CLEAN84.1 CLEAN568.P$3
NEW_249: CLEAN94.1 CLEAN569.P$3
NEW_250: CLEAN104.1 CLEAN570.P$3
NEW_251: CLEAN114.1 CLEAN571.P$3
NEW_252: CLEAN124.1 CLEAN572.P$3
NEW_253: CLEAN134.1 CLEAN573.P$3
NEW_254: CLEAN144.1 CLEAN574.P$3
NEW_255: CLEAN154.1 CLEAN575.P$3
NEW_256: CLEAN164.1 CLEAN576.P$3
NEW_257: CLEAN174.1 CLEAN577.P$3
NEW_258: CLEAN184.1 CLEAN578.P$3
NEW_259: CLEAN194.1 CLEAN579.P$3
NEW_260: CLEAN294.1 CLEAN590.P$3
NEW_261: CLEAN284.1 CLEAN591.P$3
NEW_262: CLEAN274.1 CLEAN592.P$3
NEW_263: CLEAN264.1 CLEAN593.P$3
NEW_264: CLEAN254.1 CLEAN594.P$3
NEW_265: CLEAN244.1 CLEAN595.P$3
NEW_266: CLEAN234.1 CLEAN596.P$3
NEW_267: CLEAN224.1 CLEAN597.P$3
NEW_268: CLEAN214.1 CLEAN598.P$3
NEW_269: CLEAN204.1 CLEAN599.P$3
NEW_270: CLEAN195.1 CLEAN540.P$3
NEW_271: CLEAN185.1 CLEAN541.P$3
NEW_272: CLEAN175.1 CLEAN542.P$3
NEW_273: CLEAN165.1 CLEAN543.P$3
NEW_274: CLEAN155.1 CLEAN544.P$3
NEW_275: CLEAN145.1 CLEAN545.P$3
NEW_276: CLEAN135.1 CLEAN546.P$3
NEW_277: CLEAN125.1 CLEAN547.P$3
NEW_278: CLEAN115.1 CLEAN548.P$3
NEW_279: CLEAN105.1 CLEAN549.P$3
NEW_280: CLEAN95.1 CLEAN550.P$3
NEW_281: CLEAN85.1 CLEAN551.P$3
NEW_282: CLEAN75.1 CLEAN552.P$3
NEW_283: CLEAN65.1 CLEAN553.P$3
NEW_284: CLEAN55.1 CLEAN554.P$3
NEW_285: CLEAN45.1 CLEAN555.P$3
NEW_286: CLEAN35.1 CLEAN556.P$3
NEW_287: CLEAN25.1 CLEAN557.P$3
NEW_288: CLEAN15.1 CLEAN558.P$3
NEW_289: CLEAN5.1 CLEAN559.P$3
NEW_290: CLEAN205.1 CLEAN580.P$3
NEW_291: CLEAN215.1 CLEAN581.P$3
NEW_292: CLEAN225.1 CLEAN582.P$3
NEW_293: CLEAN235.1 CLEAN583.P$3
NEW_294: CLEAN245.1 CLEAN584.P$3
NEW_295: CLEAN255.1 CLEAN585.P$3
NEW_296: CLEAN265.1 CLEAN586.P$3
NEW_297: CLEAN275.1 CLEAN587.P$3
NEW_298: CLEAN285.1 CLEAN588.P$3
NEW_299: CLEAN295.1 CLEAN589.P$3

## Library data of the parts
CLEAN0 CLEAN1-CLEAN599 = SparkFun-Connectors:M01: Header 1 Standard 1-pin 0.1" header. Use with straight break away headers (SKU : PRT-00116), right angle break away headers (PRT-00553), swiss pins (PRT-00743), machine pins (PRT-00117), and female headers (PRT-00115).